# EAGLE design DarkPill_V1.1_eagle_V7.6 (EAGLE 7.7.0)

## Sheet 1 of 3
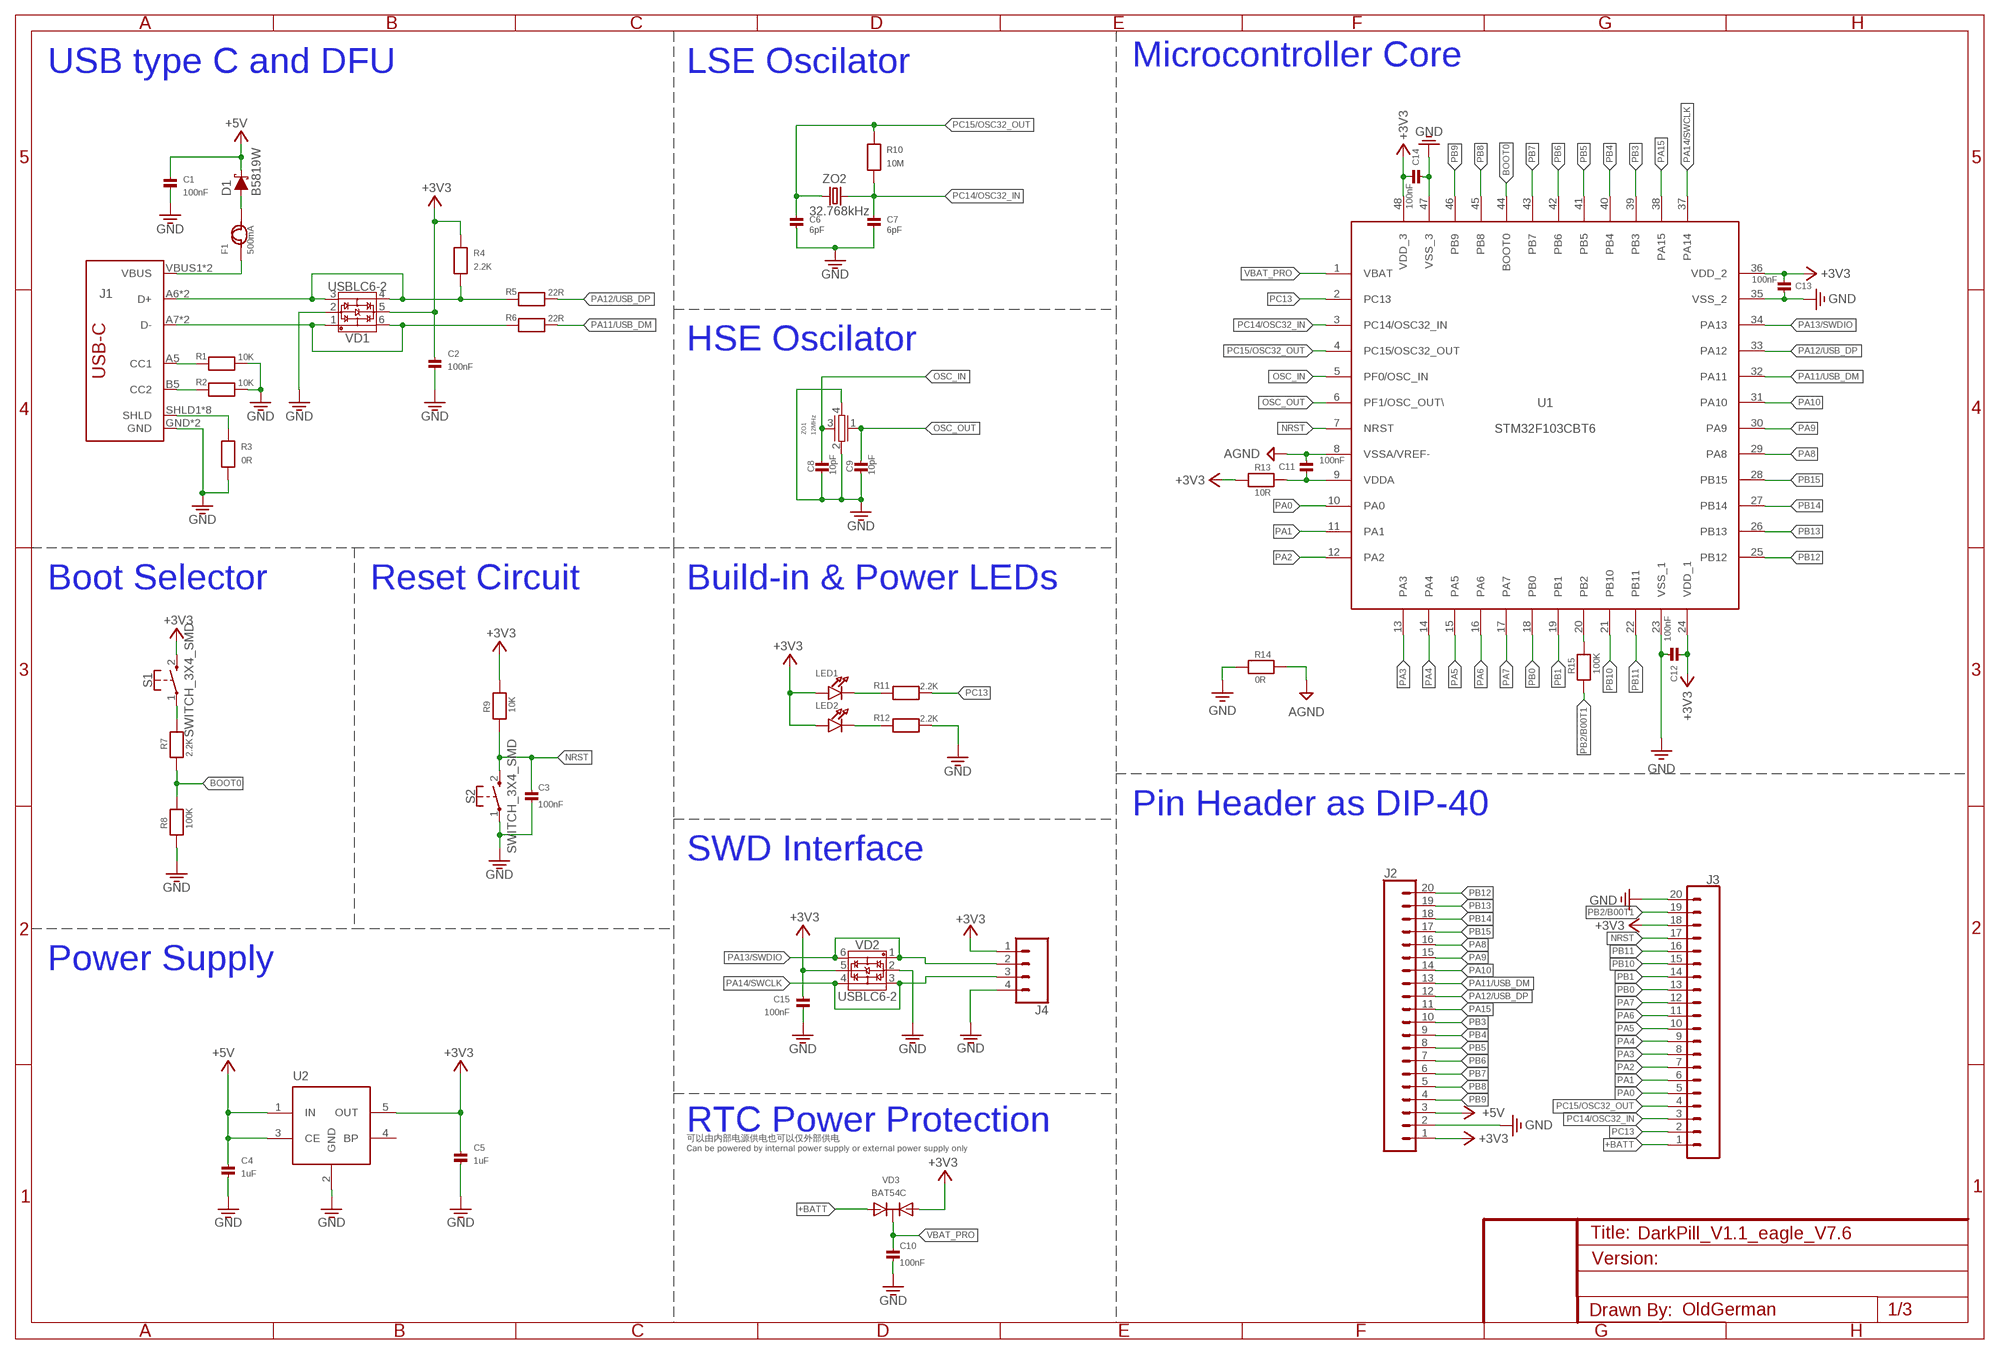
[diagram p0: schematic, sheet 1]

### Parts
C1  100nF  CAP_CERAMIC0603  [0603]
C2  100nF  CAP_CERAMIC0603  [0603]
C3  100nF  CAP_CERAMIC0603  [0603]
C4  1uF  CAP_CERAMIC0603  [0603]
C5  1uF  CAP_CERAMIC0603  [0603]
C6  6pF  CAP_CERAMIC0603  [0603]
C7  6pF  CAP_CERAMIC0603  [0603]
C8  10pF  CAP_CERAMIC0603  [0603]
C9  10pF  CAP_CERAMIC0603  [0603]
C10  100nF  CAP_CERAMIC0603  [0603]
C11  100nF  CAP_CERAMIC0603  [0603]
C12  100nF  CAP_CERAMIC0603  [0603]
C13  100nF  CAP_CERAMIC0603  [0603]
C14  100nF  CAP_CERAMIC0603  [0603]
C15  100nF  CAP_CERAMIC0603  [0603]
D1  B5819W  B5819W-SOD323  [SOD-323]
F1  500mA  FUSE  [0603]
J1  USB_C2-LAYER  [USB-C-16P]
J2  CONN_20  [1X20]
J3  CONN_20  [1X20]
J4  CONN_04PTH  [1X04]
LED1  LED_0603_MICRO  [0603_LED]
LED2  LED_0603_MICRO  [0603_LED]
R1  10K  RESISTOR0603  [0603]
R2  10K  RESISTOR0603  [0603]
R3  0R  RESISTOR0603  [0603]
R4  2.2K  RESISTOR0603  [0603]
R5  22R  RESISTOR0603  [0603]
R6  22R  RESISTOR0603  [0603]
R7  2.2K  RESISTOR0603  [0603]
R8  100K  RESISTOR0603  [0603]
R9  10K  RESISTOR0603  [0603]
R10  10M  RESISTOR0603  [0603]
R11  2.2K  RESISTOR0603  [0603]
R12  2.2K  RESISTOR0603  [0603]
R13  10R  RESISTOR0603  [0603]
R14  0R  RESISTOR0603  [0603]
R15  100K  RESISTOR0603  [0603]
S1  SWITCH_3X4_SMD  [SWITCH_3X4_SMD]
S2  SWITCH_3X4_SMD  [SWITCH_3X4_SMD]
U1  STM32F103CBT6  STM32F303CBT6  [TQFP48]
U2  ME6211C33M5G-N  [SOT23-5]
VD1  USBLC6-2  USBLC6-2SOT23-6  [SOT23-6]
VD2  USBLC6-2  USBLC6-2SOT23-6  [SOT23-6]
VD3  BAT54C  [SOT23-R]
ZO1  12MHz  3225_CRYSTALL  [3.2X2.5_KX-7]
ZO2  32.768kHz  KX-327-NHF  [3.2X1.5]

### Nets
+3V3: C2.1 C5.1 C12.2 C13.2 C14.2 C15.1 J2.1 J3.18 J4.1 LED1.1(A) LED2.1(A) R4.2 R9.1 R13.2 S1.2 U1.24(VDD_1) U1.36(VDD_2) U1.48(VDD_3) U2.5(OUT) VD1.5 VD2.5 VD3.1(A1)
+5V: C1.1 C4.1 D1.C J2.3 U2.1(IN) U2.3(CE)
+BATT: J3.1 VD3.2(A2)
AGND: C11.1 R14.1 U1.8(VSSA/VREF-)
BOOT0: R7.1 R8.1 U1.44(BOOT0)
CC1: J1.A5(CC1) R1.1
CC2: J1.B5(CC2) R2.1
D+: J1.A6(D+) J1.B6(D+) R4.1 R5.1 VD1.3 VD1.4
D-: J1.A7(D-) J1.B7(D-) R6.1 VD1.1 VD1.6
GND: C1.2 C2.2 C3.2 C4.2 C5.2 C6.1 C7.1 C8.1 C9.1 C10.2 C12.1 C13.1 C14.1 C15.2 J1.GND J1.GND2(GND) J2.2 J3.20 J4.4 R1.2 R2.2 R3.1 R8.2 R12.2 R14.2 S2.1 U1.23(VSS_1) U1.35(VSS_2) U1.47(VSS_3) U2.2(GND) VD1.2 VD2.2 ZO1.2 ZO1.4
N$1: LED1.2(C) R11.1
N$2: R7.2 S1.1
N$3: LED2.2(C) R12.1
N$5: R15.1 U1.20(PB2)
N$6: D1.A F1.2
N$7: C11.2 R13.1 U1.9(VDDA)
NRST: C3.1 J3.17 R9.2 S2.2 U1.7(NRST)
OSC_IN: C8.2 U1.5(PF0/OSC_IN) ZO1.3
OSC_OUT: C9.2 U1.6(PF1/OSC_OUT\) ZO1.1
PA0: J3.5 U1.10(PA0)
PA1: J3.6 U1.11(PA1)
PA2: J3.7 U1.12(PA2)
PA3: J3.8 U1.13(PA3)
PA4: J3.9 U1.14(PA4)
PA5: J3.10 U1.15(PA5)
PA6: J3.11 U1.16(PA6)
PA7: J3.12 U1.17(PA7)
PA8: J2.16 U1.29(PA8)
PA9: J2.15 U1.30(PA9)
PA10: J2.14 U1.31(PA10)
PA11/USB_DM: J2.13 R6.2 U1.32(PA11)
PA12/USB_DP: J2.12 R5.2 U1.33(PA12)
PA13/SWDIO: J4.2 U1.34(PA13) VD2.1 VD2.6
PA14/SWCLK: J4.3 U1.37(PA14) VD2.3 VD2.4
PA15: J2.11 U1.38(PA15)
PB0: J3.13 U1.18(PB0)
PB1: J3.14 U1.19(PB1)
PB2/B00T1: J3.19 R15.2
PB3: J2.10 U1.39(PB3)
PB4: J2.9 U1.40(PB4)
PB5: J2.8 U1.41(PB5)
PB6: J2.7 U1.42(PB6)
PB7: J2.6 U1.43(PB7)
PB8: J2.5 U1.45(PB8)
PB9: J2.4 U1.46(PB9)
PB10: J3.15 U1.21(PB10)
PB11: J3.16 U1.22(PB11)
PB12: J2.20 U1.25(PB12)
PB13: J2.19 U1.26(PB13)
PB14: J2.18 U1.27(PB14)
PB15: J2.17 U1.28(PB15)
PC13: J3.2 R11.2 U1.2(PC13)
PC14/OSC32_IN: C7.2 J3.3 R10.2 U1.3(PC14/OSC32_IN) ZO2.2
PC15/OSC32_OUT: C6.2 J3.4 R10.1 U1.4(PC15/OSC32_OUT) ZO2.1
SHLD: J1.SHLD1(SHLD) J1.SHLD2(SHLD) J1.SHLD3(SHLD) J1.SHLD4(SHLD) J1.SHLD5(SHLD) J1.SHLD6(SHLD) J1.SHLD7(SHLD) J1.SHLD8(SHLD) R3.2
VBAT_PRO: C10.1 U1.1(VBAT) VD3.3(C)
VBUS: F1.1 J1.VBUS1(VBUS) J1.VBUS2(VBUS)
Unconnected: U2.4(BP)

### Notes on the sheet
- USB type C and DFU | LSE Oscilator | Microcontroller Core
- HSE Oscilator
- Boot Selector | Reset Circuit | Build-in & Power LEDs
- Pin Header as DIP-40
- SWD Interface
- Power Supply
- RTC Power Protection
- 可以由内部电源供电也可以仅外部供电
  Can be powered by internal power supply or external power supply only
- OldGerman

## Sheet 2 of 3

## Sheet 3 of 3

## Library data of the parts
C1-C15 = microbuilder:CAP_CERAMIC: Ceramic Capacitors 0402 - 0402 Surface Mount Capacitors 16pF 50V 5% [Digikey: 445-4899-2-ND] 18pF 50V 5% [Digikey: 490-1281-2-ND] 22pF 50V 5% [Digikey: 490-1283-2-ND] 68pF 50V 5% [Digikey: 490-1289-2-ND] 0.1uF 10V 10% [Digikey: 490-1318-2-ND] 1.0uF 6.3V 10% [Digikey: 490-1320-2-ND] 0603 - 0603 Surface Mount Capacitors 16 pF 50V 5% [Digikey: 445-5051-2-ND] 22 pF 50V [Digikey: PCC220ACVTR-ND] 33 pF 50V 5% [Digikey: 490-1415-1-ND] 56pF 50V 5% [Digikey: 490-1421-1-ND] 220pF 50V 5% [Digikey: 445-1285-1-ND] 680 pF 50V 2200 pF 50V 5% C0G [Digikey: 445-1297-1-ND] 5600 pF 100V 5% X7R [Digikey: 478-3711-1-ND] 0.1 µF 25V 10% [Digikey: PCC2277TR-ND] 0.22 µF 16V 10% X7R [Digikey: 445-1318-1-ND] 1.0 µF 25V 10% [Digikey: 445-5146-2-ND] 0603 - RF Specific 3pF 250V +/-0.1pF RF [Digikey: 712-1347-1-ND] 18 pF 250V 5% [Digikey: 478-3505-1-ND or 712-1322-1-ND] 56 pF 250V 5% C0G RF [Digikey: 490-4867-1-ND] 68 pF 250V RF [Digikey: 490-4868-1-ND] 0805 - 0805 Surface Mount Capacitors 220 pF 250V 2% RF Ceramic Capacitor [Digikey: 712-1398-1-ND] 1000 pF 50V 2% NP0 Ceramic Capacitor [Digikey: 478-3760-1-ND] 0.1 µF 25V 10% Ceramic Capacitor [Digikey: PCC1828TR-ND] 1.0 µF 16V 10% Ceramic Capacitor[Digikey: 490-1691-2-ND] 10.0 µF 10V 10% Ceramic Capacitor[Digikey: 709-1228-1-ND] 10.0 uF 16V 10% Ceramic Capacitor [Digikey: 478-5165-2-ND] 47 uF 6.3V 20% Ceramic Capacitor [Digikey: 587-1779-1-ND or 399-5506-1-ND] 1206 - 1206 Surface Mount Capacitors 47uF 10V 20% Ceramic Capacitor [Digikey: 490-5528-1-ND or 399-5508-1-ND or 445-6010-1-ND] 100uF 6.3V -20%, +80% Y5V Ceramic Capacitor (Digikey: 490-4512-1-ND, Mouser: 81-GRM31CF50J107ZE1L)
D1 = DIP:B5819W-SOD323
F1 = DIP:FUSE
J1 = SparkFun-Connectors:USB_C: USB Type C 16Pin Connector Super Speed pins not available on the 16-pin purely SMD connector so this part is best for USB 2.0 implementations. D1 and D2 are tied together enabling D+/- no matter which way the cable is plugged into the connector. The two channel configuration pins (CC1/2) are exposed. These are normally connected to ground via 5.1k resistors but can be reconfigured for high current/high power applications.; PROD_ID: CONN-14122
J2 J3 = SparkFun-Connectors:CONN_20: Multi connection point. Often used as Generic Header-pin footprint for 0.1 inch spaced/style header connections On any of the 0.1 inch spaced packages, you can populate with these: Break Away Headers - Straight <https://www.sparkfun.com/products/116> (PRT-00116) Break Away Male Headers - Right Angle <https://www.sparkfun.com/products/553> (PRT-00553) Female Headers <https://www.sparkfun.com/products/115> (PRT-00115) Break Away Headers - Machine Pin <https://www.sparkfun.com/products/117> (PRT-00117) Break Away Female Headers - Swiss Machine Pin <https://www.sparkfun.com/products/743> (PRT-00743) For SCREWTERMINALS and SPRING TERMINALS visit here: Screw Terimnals on SparkFun.com <https://www.sparkfun.com/search/results?term=Screw+Terminals> (5mm/3.5mm/2.54mm spacing) This device is also useful as a general connection point to wire up your design to another part of your project. Our various solder wires solder well into these plated through hole pads. Hook-Up Wire - Assortment (Stranded, 22 AWG) <https://www.sparkfun.com/products/11375> (PRT-11375) Hook-Up Wire - Assortment (Solid Core, 22 AWG) <https://www.sparkfun.com/products/11367> (PRT-11367) View the entire wire category on our website here <https://www.sparkfun.com/categories/141> Special notes: Molex polarized connector foot print use with SKU : PRT-08231 with associated crimp pins and housings. 1MM SMD Version SKU: PRT-10208 NOTES ON THE VARIANTS LOCK and LOCK_LONGPADS... This footprint was designed to help hold the alignment of a through-hole component (i.e. 6-pin header) while soldering it into place. You may notice that each hole has been shifted either up or down by 0.005 of an inch from it's more standard position (which is a perfectly straight line). This slight alteration caused the pins (the squares in the middle) to touch the edges of the holes. Because they are alternating, it causes a "brace" to hold the component in place. 0.005 has proven to be the perfect amount of "off-center" position when using our standard breakaway headers. Although looks a little odd when you look at the bare footprint, once you have a header in there, the alteration is very hard to notice. Also,if you push a header all the way into place, it is covered up entirely on the bottom side. Note about LOCK SPECIAL package: This is just like the LOCK variant in that the holes are staggared by 5 mil, but except for the last two holes. They are not altered from the "standard" footprint layout. This is used for a special purpose on the layout of our Graphic LCD Backpack. Make sure you want to use this device before selecting it for you project!
J4 = SparkFun-Connectors:CONN_04: Multi connection point. Often used as Generic Header-pin footprint for 0.1 inch spaced/style header connections On any of the 0.1 inch spaced packages, you can populate with these: Break Away Headers - Straight <https://www.sparkfun.com/products/116> (PRT-00116) Break Away Male Headers - Right Angle <https://www.sparkfun.com/products/553> (PRT-00553) Female Headers <https://www.sparkfun.com/products/115> (PRT-00115) Break Away Headers - Machine Pin <https://www.sparkfun.com/products/117> (PRT-00117) Break Away Female Headers - Swiss Machine Pin <https://www.sparkfun.com/products/743> (PRT-00743) For SCREWTERMINALS and SPRING TERMINALS visit here: Screw Terimnals on SparkFun.com <https://www.sparkfun.com/search/results?term=Screw+Terminals> (5mm/3.5mm/2.54mm spacing) This device is also useful as a general connection point to wire up your design to another part of your project. Our various solder wires solder well into these plated through hole pads. Hook-Up Wire - Assortment (Stranded, 22 AWG) <https://www.sparkfun.com/products/11375> (PRT-11375) Hook-Up Wire - Assortment (Solid Core, 22 AWG) <https://www.sparkfun.com/products/11367> (PRT-11367) View the entire wire category on our website here <https://www.sparkfun.com/categories/141> Special notes: Molex polarized connector foot print use with SKU : PRT-08231 with associated crimp pins and housings. 1MM SMD Version SKU: PRT-10208; PROD_ID: CONN-09696
LED1 LED2 = DIP:LED_0603_MICRO: LED 0603 - 0603 Surface Mount Package 2mA: Green LED - Low Power (3.9mcd, 2ma, 1.7Vf) - Digikey: 475-2709-2-ND Orange LED - Low Power (9.8mcd, 2ma, 1.8Vf) - Digikey: 475-1194-2-ND Red LED - Low Power (5mcd, 2ma, 1.8Vf) - Digikey: 475-1195-2-ND Yellow LED - Low Power (7mcd, 2ma, 1.8Vf) - Digikey: 475-1196-2-ND 5mA: Blue LED - Low Power (17mcd, 5ma, 2.9Vf) - Digikey: LNJ937W8CRACT-ND 0805 - 0805 Surface Mount Package 2mA: Red LED (8.8mcd, 2mA, 1.8Vf, Clear) - Low Power [Digikey: 475-2510-1-ND] Green LED (5mcd, 2mA, 1.8Vf, Clear) - Low Power [Digikey: 475-2730-1-ND] Yellow LED (11.3mcd, 2mA, 1.8Vf, Clear) - Low Power [Digikey: 475-2555-1-ND] 20mA: Red LED (104mcd, 20mA, Diffused) - LS R976 [Digikey: 475-1278-6-ND] Red LED (12mcd, 20mA, 2.0Vf, Clear) - APT2012EC [Digikey: 754-1128-1-ND] Green LED (15mcd, 20mA, 2.2Vf, Clear) - APT2012GC [Digikey: 754-1131-1-ND] Orange LED (160mcd, 20mA, 2.1Vf, Clear) - APT2012SECK [Digikey: 754-1130-1-ND] 1206 - 1206 Surface Mount Package Green LED (26mcd, 20mA, Diffused) - LG N971 [Digikey: 475-1407-6-ND] Red LED (15mcd, 20mA, Diffused) - LH N974 [Digikey: 475-1416-6-ND]
R1-R15 = microbuilder:RESISTOR: Resistors 0402 - 0402 Surface Mount Package 22 Ohm 1% 1/16W [Digikey: 311-22.0LRTR-ND] 33 Ohm 5% 1/16W 1.0K 5% 1/16W 1.5K 5% 1/16W 2.0K 1% 1/16W 10.0K 1% 1/16W [Digikey: 311-10.0KLRTR-ND] 10.0K 5% 1/16W [Digikey: RMCF0402JT10K0TR-ND] 12.1K 1% 1/16W [Digikey: 311-22.0LRTR-ND] 100.0K 5% 1/16W 0603 - 0603 Surface Mount Package 0 Ohm 1/10 Watt 1% Resistor 15 Ohm 1/10 Watt 1% Resistor 33 Ohm 1/10 Watt 1% Resistor 49.9 Ohm 1/10 Watt 1% Resistor 100 Ohm 1/10 Watt 1% Resistor 150 Ohm 1/10 Watt 1% Resistor 240 Ohm 1/10 Watt 1% Resistor 390 Ohm 1/10 Watt 1% Resistor 560 Ohm 1/10 Watt 1% Resistor 680 Ohm 1/10 Watt 1% Resistor 750 Ohm 1/10 Watt 1% Resistor 1.0K Ohm 1/10 Watt 1% Resistor 1.5K Ohm 1/10 Watt 1% Resistor 2.0K Ohm 1/10 Watt 1% Resistor 2.2K Ohm 1/10 Watt 1% Resistor 3.3K Ohm 1/10 Watt 1% Resistor 4.7K Ohm 1/10 Watt 1% Resistor 10.0K Ohm 1/10 Watt 1% Resistor 12.0K Ohm 1/10 Watt 1% Resistor 12.1K Ohm 1/10 Watt 1% Resistor 20.0K Ohm 1/10 Watt 1% Resistor 33.0K Ohm 1/10 Watt 1% Resistor 100.0K Ohm 1/10 Watt 1% Resistor 0805 - 0805 Surface Mount Package 0 Ohm 1/8 Watt 1% Resistor 33 Ohm 1/8 Watt 1% Resistor 100 Ohm 1/8 Watt 1% Resistor 150 Ohm 1/8 Watt 1% Resistor 200 Ohm 1/8 Watt 1% Resistor 240 Ohm 1/8 Watt 1% Resistor 330 Ohm 1/8 Watt 1% Resistor 390 Ohm 1/8 Watt 1% Resistor 470 Ohm 1/8 Watt 1% Resistor 1.0K Ohm 1/8 Watt 1% Resistor 1.5K Ohm 1/8 Watt 1% Resistor 2.0K Ohm 1/8 Watt 1% Resistor 4.7K Ohm 1/8 Watt 1% Resistor 5.1K Ohm 1/8 Watt 1% Resistor 5.6K Ohm 1/8 Watt 1% Resistor 10.0K Ohm 1/8 Watt 1% Resistor 22.0K Ohm 1/8 Watt 1% Resistor 33.0K Ohm 1/8 Watt 1% Resistor 100K Ohm 1/8 Watt 1% Resistor 1206 - 1206 Surface Mount Package 2012 - 2010 Surface Mount Package 0.11 Ohm 1/2 Watt 1% Resistor - Digikey: RHM.11UCT-ND
S1 S2 = DIP:SWITCH_3X4_SMD
U1 = stm32f10X:STM32F303CBT6
U2 = SparkFun-IC-Power:ME6211C33M5G-N: ME621133M5G-N SOT23-5 3.3V 500mA 低差压线性稳压器
VD1 VD2 = ESD-protection:USBLC6-2
VD3 = microbuilder:BAT54C: BAT54C Schottky Diodes (Common Cathode) Vf: 800mV, 30V 200mA Digikey: BAT54CFSCT-ND For 300mA see BAT54CFILM: Vf: 900mV, 40V 300mA Digkey: 497-3786-2-ND
ZO1 = DIP:3225_CRYSTALL
ZO2 = crystal-geyer_V1_0:KX-327: Tuning Fork Crystals (kHz) SMD: KX327 - Serie Model Size l/w/h [mm] Frequency Range Frequency Stability Temp. Range [°C] Load Capacitance AECQ 200 availabel Datasheet KX-327VT KX-327FT KX-327RT KX-327NHT KX-327NHF KX-327L KX-327S 1.25/1.05/0.5 1.6/1.0/0.5 2.0/1.2/0.6 3.2/1.5/0.8 3.2/1.5/0.8 7.0/1.5/1.4 8.2/3.8/2.5 32,768 kHz 32,768 kHz 32,768 kHz 32,768 kHz 32,768 kHz 32,768 kHz 32,768 kHz ±10 … ±20ppm ±10 … ±20ppm ±10 … ±20ppm ±10 … ±20ppm ±10 … ±20ppm ±10 … ±20ppm ±5 … ±20ppm (*) -40°C …+85°C (*) -40°C …+85°C (*) -40°C …+85°C (*) -40°C …+85°C (*) -40°C …+125°C (*) -40°C …+85°C (*) -40°C …+85°C 7/9/12,5 7/9/12,5 7/9/12,6 7/9/12,5 9/12,5 7/9/12,5 6/12,5 - - - - yes - - KX-327VT.pdf <http://www.geyer-electronic.de/uploads/tx_userartikelfrequenz/GEYER-KX-327VT.pdf> KX-327FT.pdf <http://www.geyer-electronic.de/uploads/tx_userartikelfrequenz/GEYER-KX-327FT.pdf> KX-327RT.pdf <http://www.geyer-electronic.de/uploads/tx_userartikelfrequenz/GEYER-KX-327RT.pdf> KX-327NHT.pdf <http://www.geyer-electronic.de/uploads/tx_userartikelfrequenz/GEYER-KX-327NHT.pdf> KX-327NHF.pdf <http://www.geyer-electronic.de/uploads/tx_userartikelfrequenz/GEYER-KX-327NHF.pdf> KX-327L.pdf <http://www.geyer-electronic.de/uploads/tx_userartikelfrequenz/GEYER-KX-327L.pdf> KX-327S.pdf <http://www.geyer-electronic.de/uploads/tx_userartikelfrequenz/GEYER-KX-327S.pdf> <http://www.geyer-electronic.de/fileadmin/template/img/logo-geyer-electronic.png> Details see: http://www.geyer-electronic.de/Frequenz-Produkte.9.0.html Created 2016-06-07, Hans Locher 2016 (C) Geyer Quartz Technology KX327VT,KX327FT,KX327RT,KX327NHT,KX327NHF,KX327S,KX327L;125105;1610;2012;3215;7015;8238;1,25x1,05,1.25x1.05;1,6x1,0,1.6x1.0;2,0x1,2,2.0x1.2;3,2x1,5,3.2x1.5;8,2x3,8,8.2x3.8,7.0x1.5,7,0x1,532.768kHz

## Board
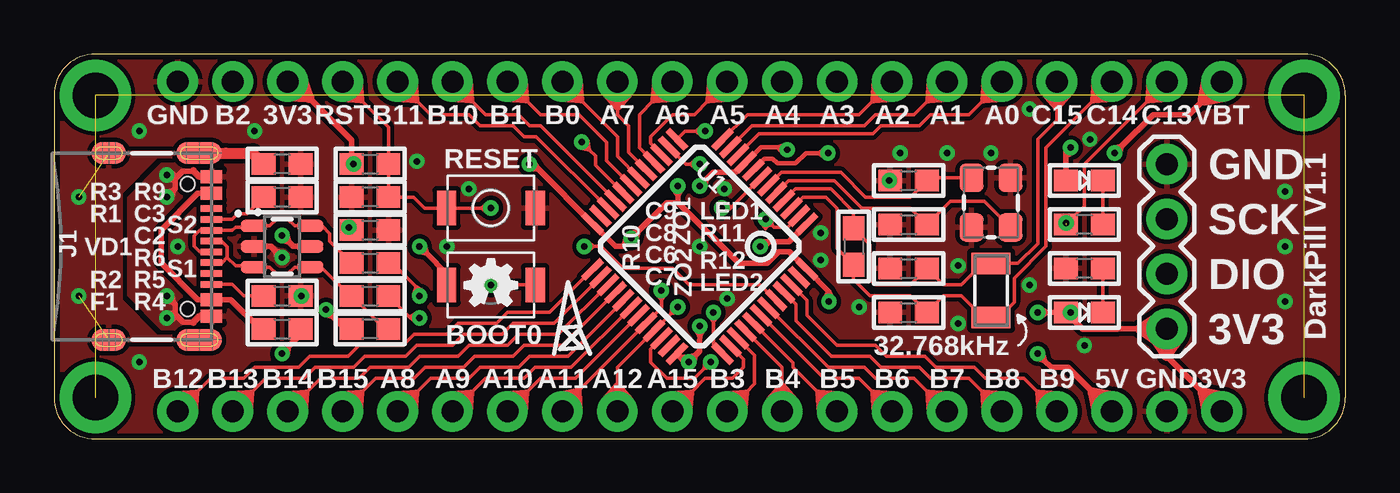
[diagram p1: board, top side]
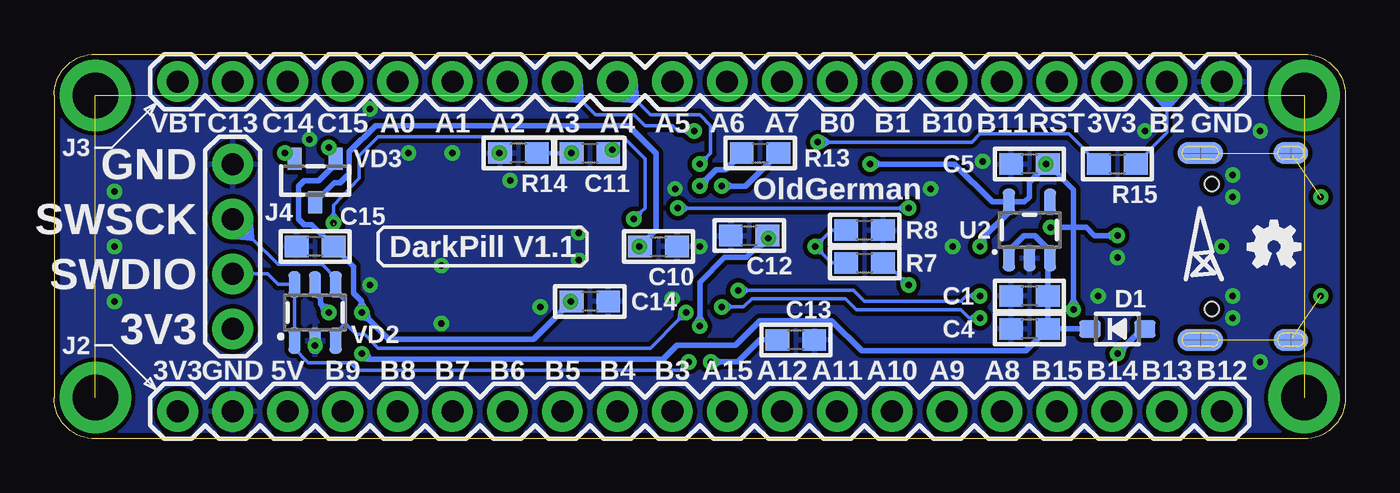
[diagram p2: board, bottom side, seen from below]

Size 59.69 x 17.78 mm. Coordinates in mm from the lower left corner, seen from the top.
Outline: 1.9,17.78 arc90 0,15.88 0,1.91 arc90 1.9,0 57.78,0 arc90 59.69,1.91 59.69,15.88 arc90 57.78,17.78 1.9,17.78
Copper layers (1*16): Top 0.035mm / dielectric 1.5mm / Bottom 0.035mm
Design rules "default *": minimum track width 6mil, minimum drill 0.3mm, track to track 8mil, track to pad 6mil, pad to pad 6mil, via to via 6mil, smd to smd 6mil, copper to edge 10mil, drill to drill 6mil, minimum pad ring 10mil, minimum via ring 8mil, stop-mask expansion 1mil, vias tented up to drill 20mil, thermal gap 8mil

### Footprints (pad centres in the part's own frame; a part is rotated, then mirrored left to right if it is on the bottom)
0603 = smd 1.1 x 1: 1 -0.85,0; 2 0.85,0
SOD-323 = smd 1 x 0.8: A 1.27,0; C -1.27,0
USB-C-16P = smd 0.3 x 1: A5 -1.25,-0.34; A6 -0.25,-0.34; A7 0.25,-0.34; A8 1.25,-0.34; B5 1.75,-0.34; B6 0.75,-0.34; B7 -0.75,-0.34; B8 -1.75,-0.34 | smd 0.6 x 1: GND -3.225,-0.34; GND2 3.225,-0.34; VBUS1 -2.45,-0.34; VBUS2 2.45,-0.34 | smd 1 x 2.1: SHLD1 -4.32,-0.915; SHLD2 4.32,-0.915 | smd 1 x 2.1 bottom: SHLD3 -4.32,-0.915; SHLD4 4.32,-0.915 | smd 1 x 1.6: SHLD5 -4.32,-5.095; SHLD8 4.32,-5.095 | smd 1 x 1.6 bottom: SHLD6 -4.32,-5.095; SHLD7 4.32,-5.095 | hole 0.65: -2.89,-1.445; 2.89,-1.445
1X20 = drill 1.016 pad 1.88: 1 0,0; 2 2.54,0; 3 5.08,0; 4 7.62,0; 5 10.16,0; 6 12.7,0; 7 15.24,0; 8 17.78,0; 9 20.32,0; 10 22.86,0; 11 25.4,0; 12 27.94,0; 13 30.48,0; 14 33.02,0; 15 35.56,0; 16 38.1,0; 17 40.64,0; 18 43.18,0; 19 45.72,0; 20 48.26,0
1X04 = drill 1.016 pad 1.88: 1 0,0; 2 2.54,0; 3 5.08,0; 4 7.62,0
0603_LED = smd 1.1 x 1: 1 -0.85,0; 2 0.85,0
SWITCH_3X4_SMD = smd 0.9 x 1.6: 1 -2.05,0; 2 2.05,0
TQFP48 = smd 0.3 x 1.2: 1 -2.75,-4.25; 2 -2.25,-4.25; 3 -1.75,-4.25; 4 -1.25,-4.25; 5 -0.75,-4.25; 6 -0.25,-4.25; 7 0.25,-4.25; 8 0.75,-4.25; 9 1.25,-4.25; 10 1.75,-4.25; 11 2.25,-4.25; 12 2.75,-4.25; 25 2.75,4.25; 26 2.25,4.25; 27 1.75,4.25; 28 1.25,4.25; 29 0.75,4.25; 30 0.25,4.25; 31 -0.25,4.25; 32 -0.75,4.25; 33 -1.25,4.25; 34 -1.75,4.25; 35 -2.25,4.25; 36 -2.75,4.25 | smd 1.2 x 0.3: 13 4.25,-2.75; 14 4.25,-2.25; 15 4.25,-1.75; 16 4.25,-1.25; 17 4.25,-0.75; 18 4.25,-0.25; 19 4.25,0.25; 20 4.25,0.75; 21 4.25,1.25; 22 4.25,1.75; 23 4.25,2.25; 24 4.25,2.75; 37 -4.25,2.75; 38 -4.25,2.25; 39 -4.25,1.75; 40 -4.25,1.25; 41 -4.25,0.75; 42 -4.25,0.25; 43 -4.25,-0.25; 44 -4.25,-0.75; 45 -4.25,-1.25; 46 -4.25,-1.75; 47 -4.25,-2.25; 48 -4.25,-2.75
SOT23-5 = smd 0.55 x 1.2: 1 -0.95,-1.3; 2 0,-1.3; 3 0.95,-1.3; 4 0.95,1.3; 5 -0.95,1.3
SOT23-6 = smd 0.55 x 1.2: 1 0.95,1.3; 2 0,1.3; 3 -0.95,1.3; 4 -0.95,-1.3; 5 0,-1.3; 6 0.95,-1.3
SOT23-R = smd 0.635 x 1.016: 1 -0.95,-1; 2 0.95,-1; 3 0,1
3.2X2.5_KX-7 = smd 1.3 x 1.1: 1 -1.15,-0.9; 2 1.15,-0.9; 3 1.15,0.9; 4 -1.15,0.9
3.2X1.5 = smd 1 x 1.8: 1 -1.25,0; 2 1.25,0

### Placement (x,y rotation side)
C1  14.6,6.6 180 bottom
C2  14.6,9.65 0 top
C3  14.6,11.18 180 top
C4  14.6,5.08 180 bottom
C5  14.6,12.7 180 bottom
C6  39.5,7.87 0 top
C7  39.5,5.84 0 top
C8  39.5,9.91 0 top
C9  39.5,11.94 0 top
C10  31.75,8.89 0 bottom
C11  34.92,13.21 0 bottom
C12  27.56,9.4 0 bottom
C13  25.4,4.57 180 bottom
C14  34.92,6.35 180 bottom
C15  47.62,8.89 180 bottom
D1  10.54,5.08 0 bottom
F1  10.54,5.08 0 top
J1  7.62,8.89 270 top
J2  53.97,1.27 0 bottom
J3  53.97,16.51 0 bottom
J4  51.44,5.08 90 top
LED1  47.62,11.94 0 top
LED2  47.62,5.84 0 top
R1  10.54,11.18 0 top
R2  10.54,6.6 0 top
R3  10.54,12.7 180 top
R4  14.6,5.08 180 top
R5  14.6,6.6 0 top
R6  14.6,8.13 0 top
R7  22.22,8.13 0 bottom
R8  22.22,9.65 0 bottom
R9  14.6,12.7 0 top
R10  36.96,8.89 270 top
R11  47.62,9.91 180 top
R12  47.62,7.87 180 top
R13  27.05,13.21 0 bottom
R14  38.23,13.21 180 bottom
R15  10.54,12.7 0 bottom
S1  20.19,7.11 180 top
S2  20.19,10.67 180 top
U1  29.84,8.89 135 top
U2  14.6,9.65 0 bottom
U$1  [OSHW-LOGO-MINI]  20.19,7.11 0 top
U$2  [OSHW-LOGO-MINI]  3.3,8.89 0 bottom
U$3  [CREATIVE_COMMONS]  6.73,-10.92 0 top  (outside the outline)
VD1  10.54,8.89 90 top
VD2  47.62,5.84 180 bottom
VD3  47.62,11.94 180 bottom
ZO1  43.31,10.92 270 top
ZO2  43.31,6.86 270 top

### Tracks (layer width: path | path; a pad name or v marks a point on that pad's centre or on a via)
+3V3  (via drill 0.3)
  Top 0.254: v29.34,3.56 29.17,3.56 28.95,3.78 | U1.36 28.95,3.78 | 26.35,8.95 26.29,8.89 25.96,8.89 U1.24 22.36,12.48 | 26.35,8.95 v26.67,9.27 | VD1.5 11.05,8.89 10.86,9.08 | 10.86,9.08 v10.54,9.4 | v13.84,12.7 R9.1 13.75,13.14 | J2.1 53.11,2.13 51.44,3.81 51.44,3.86 J4.1 50.22,5.08 49.16,5.08 49.14,5.06 47.55,5.06 47.18,5.44 | 13.75,13.14 13.75,13.8 11.77,15.78 11.05,16.51 J3.18 | 35.81,6.8 | 35.81,6.8 v35.81,6.35 | 47.18,5.44 LED2.1 | 28.83,10.92 31.65,8.11 32.96,8.11 33.49,8.64 33.99,8.64 U1.48 35.82,6.81 35.81,6.8 | 28.83,10.92 28.32,10.92 26.99,9.59 | 26.99,9.59 v26.67,9.27 | 22.36,12.48 22.15,12.7 v21.97,12.7 | LED1.1 46.77,13.07 | 46.77,13.07 46.77,13.25 v46.99,13.46 | v12.57,5.97 12.89,5.65 | 12.89,5.65 13.46,5.08 R4.2 | 46.46,5.53 46.58,5.65 | 46.58,5.65 LED2.1 | S1.2 18.14,7.64 17.21,8.57 | 17.21,8.57 v16.89,8.89 | v29.34,3.56 29.65,3.87 | 29.65,3.87 29.84,4.06 v29.84,5.21 | C2.1 v13.63,9.78 | v28.83,11.68 28.83,11.23 | 28.83,11.23 | 28.83,11.23 28.83,10.92 | v46.99,5.84 LED2.1 | v45.47,5.84 45.92,5.84 | 45.92,5.84 46.54,5.84 | 46.54,5.84 LED2.1 | 28.95,3.78 29.14,3.44 v29.34,3.56 | 28.95,3.78 29.33,3.78 v29.34,3.56 | 29.65,3.87 29.28,3.78 v29.34,3.56 | 29.65,3.87 29.56,3.5 v29.34,3.56 | 26.35,8.95 26.73,9.05 v26.67,9.27 | 26.35,8.95 26.45,9.33 v26.67,9.27 | 26.99,9.59 26.61,9.49 v26.67,9.27 | 26.99,9.59 26.89,9.21 v26.67,9.27 | 10.86,9.08 10.76,9.46 v10.54,9.4 | 10.86,9.08 10.48,9.18 v10.54,9.4 | 13.75,13.14 13.63,12.77 v13.84,12.7 | 13.75,13.14 14.01,12.85 v13.84,12.7 | 35.81,6.8 | 35.81,6.8 35.62,6.46 | 35.81,6.8 36.01,6.46 | 35.81,6.8 35.62,6.46 | 35.81,6.8 36.01,6.46 | v35.81,6.35 36.01,6.46 | 35.81,6.8 35.62,6.46 | v35.81,6.35 35.62,6.46
  Top 0.254: 35.81,6.8 36.01,6.46 | 35.81,6.8 35.62,6.46 | v35.81,6.35 35.62,6.46 | 35.81,6.8 36.01,6.46 | v35.81,6.35 36.01,6.46 | 35.81,6.8 35.62,6.46 | v35.81,6.35 35.62,6.46 | 35.81,6.8 36.01,6.46 | v35.81,6.35 36.01,6.46 | 22.36,12.48 22.16,12.82 v21.97,12.7 | 22.36,12.48 21.97,12.47 v21.97,12.7 | 46.77,13.07 47.11,13.27 v46.99,13.46 | 46.77,13.07 46.76,13.46 v46.99,13.46 | 12.89,5.65 12.79,6.03 v12.57,5.97 | 12.89,5.65 12.52,5.75 v12.57,5.97 | 47.18,5.44 47.22,5.82 v46.99,5.84 | 47.18,5.44 46.86,5.66 v46.99,5.84 | 46.58,5.65 46.97,5.62 v46.99,5.84 | 46.58,5.65 46.8,5.97 v46.99,5.84 | 46.54,5.84 46.88,5.65 v46.99,5.84 | 46.54,5.84 46.88,6.04 v46.99,5.84 | 17.21,8.57 17.11,8.95 v16.89,8.89 | 17.21,8.57 16.83,8.67 v16.89,8.89 | 29.84,4.76 30.04,5.09 | v29.84,5.21 30.04,5.09 | 29.84,4.76 30.04,5.09 | v29.84,5.21 30.04,5.09 | 29.84,4.76 29.65,5.09 v29.84,5.21 | 28.83,11.23 | 28.83,11.23 29.02,11.57 | v28.83,11.68 29.02,11.57 | 28.83,11.23 28.63,11.57 | v28.83,11.68 28.63,11.57 | 28.83,11.23 29.02,11.57 | v28.83,11.68 29.02,11.57 | 28.83,11.23 28.63,11.57 | v28.83,11.68 28.63,11.57 | 28.83,11.23 29.02,11.57 | v28.83,11.68 29.02,11.57 | 28.83,11.23 28.63,11.57 | v28.83,11.68 28.63,11.57 | 45.92,5.84 45.58,6.04 v45.47,5.84 | 45.92,5.84 45.58,5.65 v45.47,5.84
  Top 0.508: J4.1 52,4.69 51.44,3.86 50.87,4.69 J4.1 | J4.1 51.05,4.51 50.22,5.08 51.05,5.65 J4.1 | 53.11,2.13 53.3,1.14 J2.1 54.1,1.94 53.11,2.13 | 11.77,15.78 11.44,16.74 J3.18 10.77,15.82 11.77,15.78
  Bottom 0.254: v29.34,3.56 28.89,3.56 | 28.89,3.56 | 28.89,3.56 28.07,3.56 27.05,4.57 C13.2 | v10.54,9.4 10.99,9.4 | 10.99,9.4 | 10.99,9.4 11.6,9.4 11.98,9.78 12.57,9.78 | v13.63,9.78 13.18,9.78 | 13.18,9.78 | 13.18,9.78 12.57,9.78 | 14.11,12.34 14.6,11.85 14.6,11.18 14.83,10.95 U2.5 | 14.11,12.34 R9.1 | R9.1 13.48,12.43 | 13.48,12.43 | 13.48,12.43 12.57,11.52 12.57,9.78 | R9.1 v13.84,12.7 | v46.99,13.46 46.67,13.15 46.67,13.14 | 46.67,13.14 VD3.1 46.72,12.94 46.59,12.81 47.47,11.94 48.13,11.94 48.39,11.68 48.39,10.16 48.13,9.91 47.79,9.91 C15.1 45.85,7.96 45.85,6.73 45.47,6.35 45.47,6.29 | 12.57,9.78 12.57,6.42 | 12.57,6.42 | 12.57,6.42 v12.57,5.97 | v21.97,12.7 21.52,12.7 | 21.52,12.7 | 21.52,12.7 18.06,12.7 16.32,10.95 U2.5 | 27.21,8.86 27.69,8.38 28.7,8.38 29.84,7.24 29.84,5.66 | 27.21,8.86 27.16,8.91 26.99,8.95 | 26.99,8.95 v26.67,9.27 | C12.2 26.67,9.36 v26.67,9.27 | 29.84,5.66 | 29.84,5.66 v29.84,5.21 | v16.89,8.89 16.89,9.14 16.73,9.31 | 16.73,9.31 15.55,10.48 U2.5 | 27.21,8.86 27.11,9.21 | 27.11,9.21 27.07,9.38 26.89,9.33 | 36.11,6.01 37.52,4.61 44.23,4.61 45.15,5.52 | 36.11,6.01 C14.2 v35.81,6.35 | R13.2 27.72,11.68 28.38,11.68 | 28.38,11.68 | 28.38,11.68 v28.83,11.68 | 13.48,12.43 | 13.48,12.43 13.87,12.48 | 13.87,12.48 | 13.48,12.43 13.63,12.79 | VD2.5 47.62,6.76 47.37,6.51 47.37,6.25 47.29,6.18 | 47.29,6.18 46.99,5.87 v46.99,5.84 | v45.47,5.84 45.15,5.52 | v45.47,5.84 45.47,6.29 | 45.47,6.29 | 28.89,3.56 29.22,3.36 | 28.89,3.56 | 28.89,3.56 29.22,3.36 | v29.34,3.56 29.22,3.36 | 28.89,3.56 | 28.89,3.56 29.22,3.75 | 28.89,3.56 29.22,3.36 | 28.89,3.56 | 28.89,3.56 29.22,3.75 | v29.34,3.56 29.22,3.75 | 28.89,3.56 29.22,3.36 | 28.89,3.56 29.22,3.75 | 28.89,3.56 29.22,3.36
  Bottom 0.254: v29.34,3.56 29.22,3.36 | 28.89,3.56 29.22,3.75 | v29.34,3.56 29.22,3.75 | 28.89,3.56 29.22,3.36 | v29.34,3.56 29.22,3.36 | 28.89,3.56 29.22,3.75 | v29.34,3.56 29.22,3.75 | 27.11,9.21 26.81,9.45 v26.67,9.27 | 27.11,9.21 26.75,9.06 v26.67,9.27 | 26.99,8.95 26.89,9.33 | v26.67,9.27 26.89,9.33 | 26.99,8.95 26.61,9.05 v26.67,9.27 | 10.99,9.4 10.65,9.59 | 10.99,9.4 | 10.99,9.4 10.65,9.59 | v10.54,9.4 10.65,9.59 | 10.99,9.4 | 10.99,9.4 10.65,9.2 | 10.99,9.4 10.65,9.59 | 10.99,9.4 | 10.99,9.4 10.65,9.2 | v10.54,9.4 10.65,9.2 | 10.99,9.4 10.65,9.59 | 10.99,9.4 10.65,9.2 | 10.99,9.4 10.65,9.59 | v10.54,9.4 10.65,9.59 | 10.99,9.4 10.65,9.2 | v10.54,9.4 10.65,9.2 | 10.99,9.4 10.65,9.59 | v10.54,9.4 10.65,9.59 | 10.99,9.4 10.65,9.2 | v10.54,9.4 10.65,9.2 | 13.18,9.78 13.51,9.98 | 13.18,9.78 | 13.18,9.78 13.51,9.58 | v13.63,9.78 13.51,9.58 | 13.18,9.78 13.51,9.98 | 13.18,9.78 | 13.18,9.78 13.51,9.58 | 13.18,9.78 | 13.18,9.78 13.51,9.98 | v13.63,9.78 13.51,9.98 | 13.18,9.78 13.51,9.58 | v13.63,9.78 13.51,9.58 | 13.18,9.78 13.51,9.98 | v13.63,9.78 13.51,9.98 | 13.18,9.78 13.51,9.58 | 13.18,9.78 13.51,9.98 | 13.18,9.78 13.51,9.58 | v13.63,9.78 13.51,9.58 | 13.18,9.78 13.51,9.98 | v13.63,9.78 13.51,9.98 | 14.11,12.34 | 14.11,12.34 14.07,12.73 | 14.07,12.73 | 14.11,12.34 | 13.48,12.43 | 13.48,12.43 13.87,12.48 | 13.48,12.43 13.63,12.79 | 14.11,12.34 14.07,12.73 | 14.11,12.34 13.75,12.49 | 14.11,12.34 14.07,12.73 | v13.84,12.7 14.07,12.73 | 14.11,12.34 13.75,12.49 | v13.84,12.7 13.75,12.49 | 13.48,12.43 13.87,12.48 | v13.84,12.7 13.87,12.48 | 13.48,12.43 13.63,12.79 | v13.84,12.7 13.63,12.79 | 36.11,6.01 36.04,6.39 v35.81,6.35 | 36.11,6.01 35.74,6.14 v35.81,6.35 | 21.52,12.7 21.86,12.9 | 21.52,12.7 | 21.52,12.7 21.86,12.5
  Bottom 0.254: v21.97,12.7 21.86,12.5 | 21.52,12.7 21.86,12.9 | 21.52,12.7 | 21.52,12.7 21.86,12.5 | 21.52,12.7 | 21.52,12.7 21.86,12.9 | v21.97,12.7 21.86,12.9 | 21.52,12.7 21.86,12.5 | v21.97,12.7 21.86,12.5 | 21.52,12.7 21.86,12.9 | v21.97,12.7 21.86,12.9 | 21.52,12.7 21.86,12.5 | 21.52,12.7 21.86,12.9 | 21.52,12.7 21.86,12.5 | v21.97,12.7 21.86,12.5 | 21.52,12.7 21.86,12.9 | v21.97,12.7 21.86,12.9 | 46.67,13.14 47.05,13.24 v46.99,13.46 | 46.67,13.14 46.77,13.52 v46.99,13.46 | 12.57,6.42 12.38,6.08 | 12.57,6.42 | 12.57,6.42 12.38,6.08 | v12.57,5.97 12.38,6.08 | 12.57,6.42 | 12.57,6.42 12.77,6.08 | 12.57,6.42 12.38,6.08 | 12.57,6.42 | 12.57,6.42 12.77,6.08 | v12.57,5.97 12.77,6.08 | 12.57,6.42 12.38,6.08 | 12.57,6.42 12.77,6.08 | 12.57,6.42 12.38,6.08 | v12.57,5.97 12.38,6.08 | 12.57,6.42 12.77,6.08 | v12.57,5.97 12.77,6.08 | 12.57,6.42 12.38,6.08 | v12.57,5.97 12.38,6.08 | 12.57,6.42 12.77,6.08 | v12.57,5.97 12.77,6.08 | 47.29,6.18 46.92,6.06 v46.99,5.84 | 47.29,6.18 47.21,5.79 v46.99,5.84 | 16.73,9.31 16.67,8.92 v16.89,8.89 | 16.73,9.31 17.03,9.07 v16.89,8.89 | 29.84,5.66 29.65,5.32 | v29.84,5.21 29.65,5.32 | 29.84,5.66 30.04,5.32 | 29.84,5.66 29.65,5.32 | 29.84,5.66 30.04,5.32 | v29.84,5.21 30.04,5.32 | 29.84,5.66 29.65,5.32 | v29.84,5.21 29.65,5.32 | 29.84,5.66 30.04,5.32 | v29.84,5.21 30.04,5.32 | 29.84,5.66 29.65,5.32 | v29.84,5.21 29.65,5.32 | 29.84,5.66 30.04,5.32 | v29.84,5.21 30.04,5.32 | 28.38,11.68 | 28.38,11.68 28.71,11.49 | 28.38,11.68 28.71,11.88 | v28.83,11.68 28.71,11.88 | v28.83,11.68 28.71,11.49 | 28.38,11.68 28.71,11.88 | v28.83,11.68 28.71,11.49 | v28.83,11.68 28.71,11.88 | v28.83,11.68 28.71,11.49 | v28.83,11.68 28.71,11.88 | 45.47,6.29 | 45.47,6.29 45.27,5.96 | v45.47,5.84 45.27,5.96
  Bottom 0.254: 45.47,6.29 45.66,5.96 | v45.47,5.84 45.66,5.96 | 45.15,5.52 45.52,5.62 v45.47,5.84 | 45.15,5.52 45.25,5.9 v45.47,5.84 | 45.47,6.29 45.27,5.96 | v45.47,5.84 45.27,5.96 | 45.47,6.29 45.66,5.96 | v45.47,5.84 45.66,5.96 | 45.47,6.29 45.27,5.96 | v45.47,5.84 45.27,5.96 | 45.47,6.29 45.66,5.96 | v45.47,5.84 45.66,5.96
+5V  (via drill 0.3)
  Top 0.254: J2.3 48.03,2.13 46.86,3.3 46.1,3.3 45.78,3.62 | 45.78,3.62 v45.47,3.94 | 45.78,3.62 45.69,4 v45.47,3.94 | 45.78,3.62 45.41,3.72 v45.47,3.94
  Top 0.508: 48.03,2.13 48.22,1.14 J2.3 49.02,1.94 48.03,2.13
  Bottom 0.254: C4.1 C1.1 13.75,8.25 U2.3 13.65,8.7 14.35,9.4 14.86,9.4 15.55,8.7 U2.1 | v45.47,3.94 45.21,3.68 45.09,3.68 | 45.09,3.68 31.54,3.68 30.9,4.32 28.19,4.32 27.05,5.46 23.75,5.46 22.35,4.06 14.77,4.06 C4.1 | C4.1 D1.C | 45.09,3.68 45.48,3.71 v45.47,3.94 | 45.09,3.68 45.26,4.03 v45.47,3.94
+BATT  (via drill 0.3)
  Top 0.254: J3.1 53.11,15.65 52.45,14.99 50.8,14.99 49.34,13.53 | v49.02,13.21 49.34,13.53 | 49.34,13.53 48.96,13.43 v49.02,13.21 | 49.34,13.53 49.24,13.15 v49.02,13.21
  Top 0.508: 53.11,15.65 54.1,15.84 J3.1 53.3,16.64 53.11,15.65
  Bottom 0.203: VD3.2 48.63,12.99 | 48.63,12.99 48.84,13.21 v49.02,13.21 | 48.63,12.99 49,12.96 v49.02,13.21 | 48.63,12.99 48.8,13.32 v49.02,13.21
AGND  (via drill 0.3)
  Top 0.203: U1.8 32.85,12.95 33.22,12.95 33.45,12.73 34.28,12.73 34.76,13.21 35.33,13.21 | 35.33,13.21 | 35.33,13.21 C11.1 | 35.33,13.21 | 35.33,13.21 35.63,13 | C11.1 35.63,13 | 35.33,13.21 35.63,13.42 | C11.1 35.63,13.42 | 35.33,13.21 35.63,13 | 35.63,13 | C11.1 35.63,13 | 35.33,13.21 35.63,13.42 | C11.1 35.63,13.42 | 35.33,13.21 35.63,13 | C11.1 35.63,13 | 35.33,13.21 35.63,13.42 | C11.1 35.63,13.42
  Bottom 0.203: C11.1 36.23,13.21 | 36.23,13.21 | 36.23,13.21 R14.1 | 35.92,13 | 35.92,13 | 36.23,13.21 35.92,13.42 | 36.23,13.21 35.92,13.42 | 35.92,13.42 | C11.1 35.92,13.42 | 36.23,13.21 35.92,13 | C11.1 35.92,13 | 35.92,13 | 36.23,13.21 35.92,13.42 | C11.1 35.92,13.42 | 36.23,13.21 35.92,13 | 35.92,13 | C11.1 35.92,13 | 36.23,13.21 35.92,13.42 | C11.1 35.92,13.42 | 36.23,13.21 | 36.23,13.21 35.92,13 | C11.1 35.92,13 | 36.23,13.21 35.92,13.42 | C11.1 35.92,13.42 | 36.23,13.21 35.92,13 | C11.1 35.92,13
  other vias: 35.77,13.21
BOOT0  (via drill 0.3)
  Top 0.152: U1.44 33.34,6.42 32.64,7.11 29.34,7.11 28.57,7.87 26.29,7.87 25.27,8.89 24.96,8.89 | 24.96,8.89 | 24.96,8.89 v24.51,8.89 | 24.96,8.89 24.68,9.11 | v24.51,8.89 24.68,9.11 | 24.96,8.89 24.68,8.67 | 24.96,8.89 24.68,9.11 | 24.96,8.89 24.68,8.67 | v24.51,8.89 24.68,8.67 | 24.96,8.89 24.68,9.11 | v24.51,8.89 24.68,9.11 | 24.96,8.89 24.68,8.67 | v24.51,8.89 24.68,8.67 | 24.96,8.89 24.68,9.11 | v24.51,8.89 24.68,9.11 | 24.96,8.89 24.68,8.67 | v24.51,8.89 24.68,8.67
  Bottom 0.152: v24.51,8.89 24.19,8.57 | 24.19,8.57 | 24.19,8.57 23.75,8.13 R7.1 | v24.51,8.89 24.19,9.21 | 24.19,9.21 | 24.19,9.21 23.75,9.65 R8.1 | 24.19,8.57 24.54,8.62 | 24.54,8.62 | 24.19,8.57 24.24,8.92 | 24.24,8.92 | 24.19,9.21 24.24,8.86 | 24.24,8.86 | 24.19,9.21 24.54,9.17 | 24.54,9.17 | 24.24,8.92 | 24.54,9.17 | 24.54,8.62 | v24.51,8.89 24.54,8.62 | 24.19,8.57 24.24,8.92 | v24.51,8.89 24.24,8.92 | 24.19,8.57 24.54,8.62 | v24.51,8.89 24.54,8.62 | 24.19,8.57 24.24,8.92 | v24.51,8.89 24.24,8.92 | 24.24,8.86 | v24.51,8.89 24.24,8.86 | 24.19,9.21 24.54,9.17 | v24.51,8.89 24.54,9.17 | 24.19,9.21 24.24,8.86 | v24.51,8.89 24.24,8.86 | 24.19,9.21 24.54,9.17 | v24.51,8.89 24.54,9.17
CC1
  Top 0.152: J1.A5 8.23,10.14 8.51,10.41 8.93,10.41 R1.1
CC2
  Top 0.152: J1.B5 8.23,7.14 8.76,6.6 R2.1
D+
  Top 0.152: J1.A6 7.75,9.14 8.01,8.88 8.01,8.39 | 8.01,8.39 8.01,8.37 8.38,8 9.18,8 VD1.3 9.97,7.94 10.29,7.62 10.79,7.62 11.11,7.94 VD1.4 12.35,7.94 13.68,6.6 R5.1 15.28,5.08 R4.1 | J1.B6 7.76,8.14 8.01,8.39
D-
  Top 0.152: J1.A7 6.73,8.64 6.48,8.89 6.48,9.4 6.72,9.64 J1.B7 8.24,9.64 8.38,9.78 9.18,9.78 VD1.1 9.97,9.84 10.29,10.16 10.79,10.16 11.11,9.84 VD1.6 12.38,9.84 12.74,9.49 12.74,9.14 R6.1
GND  (via drill 0.3)
  Top 0.254: v10.54,8.38 10.51,8.38 10.21,8.69 | VD1.2 10,8.89 10.21,8.69 | 6.43,12.39 6.4,12.36 5.93,12.36 5.64,12.06 | 5.64,12.06 5.6,12.02 5.6,11.97 | 5.6,11.97 5.6,11.57 5.52,11.49 | 5.52,11.49 v5.21,11.18 | 5.6,5.81 5.6,5.76 5.64,5.72 | 5.6,5.81 5.6,6.22 5.52,6.29 | 5.52,6.29 v5.21,6.6 | 6.43,5.39 5.97,5.39 5.64,5.72 | 10.21,8.69 10.32,8.31 v10.54,8.38 | 10.21,8.69 10.59,8.6 v10.54,8.38 | 5.52,11.49 5.15,11.39 v5.21,11.18 | 5.52,11.49 5.43,11.12 v5.21,11.18 | 5.52,6.29 5.43,6.66 v5.21,6.6 | 5.52,6.29 5.15,6.39 v5.21,6.6 | 5.6,5.81 5.21,5.81 v5.21,5.59 | 5.6,5.81 5.4,5.48 v5.21,5.59 | 5.64,5.72 5.26,5.81 v5.21,5.59 | 5.64,5.72 5.37,5.43 v5.21,5.59 | 5.64,12.06 5.37,12.35 v5.21,12.19 | 5.64,12.06 5.26,11.97 v5.21,12.19 | 5.6,11.97 5.4,12.3 v5.21,12.19 | 5.6,11.97 5.21,11.97 v5.21,12.19
  Top 0.33: J1.GND2 6.71,5.67 6.43,5.39 | J1.GND 6.71,12.12 6.43,12.39
  other vias: 3.94,3.56 5.71,8.89 9.27,14.22 29.84,8.89 19.18,11.56 31.11,6.48 38.61,11.94 41.78,8 39.12,13.21 11.43,6.6 37.21,6.1 30.99,11.56 41.27,13.21 43.31,13.21 45.09,7.11 35.43,9.53 35.43,8.26 41.78,5.33 56.9,6.35 56.9,8.89 56.9,11.43 3.94,14.22 47.88,13.84 18.16,8.89 16.76,12.83 45.09,15.24 47.62,4.32
  pour Bottom (rank 2): 59.44,-0.63 59.44,18.41 -0.64,18.41 -0.64,-0.63
  pour Top (rank 2): 59.44,18.41 59.44,-0.63 -0.64,-0.63 -0.64,18.41
N$1
  Top 0.152: R11.1 LED1.2
N$2  (via drill 0.3)
  Top 0.152: S1.1 20.64,7.11 | 20.64,7.11 | 20.64,7.11 v20.19,7.11 | 20.64,7.11 | 20.64,7.11 20.36,7.33 | 20.64,7.11 20.36,7.33 | 20.64,7.11 20.36,6.89 | v20.19,7.11 20.36,6.89 | 20.64,7.11 20.36,7.33 | v20.19,7.11 20.36,7.33 | 20.64,7.11 20.36,6.89 | 20.64,7.11 20.36,7.33 | v20.19,7.11 20.36,7.33 | 20.64,7.11 20.36,6.89 | v20.19,7.11 20.36,6.89 | 20.64,7.11 20.36,7.33 | v20.19,7.11 20.36,7.33 | 20.64,7.11 20.36,6.89 | v20.19,7.11 20.36,6.89
  Bottom 0.152: R7.2 21.21,8.13 20.51,7.43 | 20.51,7.43 v20.19,7.11 | 20.16,7.39 | 20.47,7.08 | 20.51,7.43 20.16,7.39 | 20.16,7.39 | 20.51,7.43 20.47,7.08 | v20.19,7.11 20.47,7.08 | 20.51,7.43 20.16,7.39 | v20.19,7.11 20.16,7.39 | 20.51,7.43 | 20.51,7.43 20.16,7.39 | 20.51,7.43 | 20.51,7.43 20.47,7.08 | 20.51,7.43 20.16,7.39 | v20.19,7.11 20.16,7.39 | 20.51,7.43 20.47,7.08 | v20.19,7.11 20.47,7.08 | 20.51,7.43 20.16,7.39 | v20.19,7.11 20.16,7.39 | 20.51,7.43 20.47,7.08 | v20.19,7.11 20.47,7.08
N$3
  Top 0.152: LED2.2 R12.1
N$4  (via drill 2.1 pad 3.3)  (3 unrouted)
  other vias: 1.9,15.88 1.9,1.91 57.78,1.91 57.78,15.88
N$5  (via drill 0.3)
  Top 0.152: U1.20 25.02,12.66 25.02,13.08 24.75,13.35 | 24.75,13.35 24.7,13.4 | 24.7,13.4 v24.38,13.72 | 24.75,13.35 24.68,13.77 v24.38,13.72 | 24.75,13.35 24.33,13.42 v24.38,13.72 | 24.7,13.4 24.66,13.75 v24.38,13.72 | 24.7,13.4 24.35,13.44 v24.38,13.72 | v24.38,13.72 24.65,13.78 24.74,13.44 24.38,13.44 v24.38,13.72 | v24.38,13.72 24.66,13.72 24.66,13.36 24.32,13.45 v24.38,13.72
  Bottom 0.152: v24.38,13.72 23.93,13.72 | 23.93,13.72 | 23.93,13.72 23.86,13.72 | 23.86,13.72 | 23.86,13.72 17.27,13.72 16.89,14.1 12.79,14.1 R15.1 | 23.86,13.72 | 23.94,13.66 24.21,13.47 | 24.21,13.47 | 23.86,13.72 24.21,13.96 | 24.21,13.96 | 23.86,13.72 23.94,13.66 | 23.94,13.66 24.21,13.47 | 24.21,13.47 | v24.38,13.72 24.21,13.47 | 23.86,13.72 23.94,13.77 | 23.94,13.77 24.21,13.96 | v24.38,13.72 24.21,13.96 | 23.86,13.72 23.94,13.66 | 23.94,13.66 24.21,13.47 | v24.38,13.72 24.21,13.47 | 23.86,13.72 23.94,13.77 | 23.94,13.77 24.21,13.96 | v24.38,13.72 24.21,13.96 | 23.94,13.66 24.24,13.48 | 23.94,13.77 24.24,13.95 | 23.93,13.72 | 23.93,13.72 24.21,13.5 | 23.93,13.72 24.21,13.93 | 23.94,13.77 24.19,13.52 | v24.38,13.72 24.19,13.52 | 23.94,13.77 24.24,13.95 | 24.24,13.95 | v24.38,13.72 24.24,13.95 | 23.94,13.66 24.19,13.91 | 24.19,13.91 | 23.93,13.72 24.21,13.5 | v24.38,13.72 24.21,13.5 | 23.93,13.72 24.21,13.93 | v24.38,13.72 24.21,13.93 | 23.93,13.72 24.21,13.5 | v24.38,13.72 24.21,13.5 | 23.93,13.72 24.21,13.93 | v24.38,13.72 24.21,13.93 | 23.94,13.66 24.24,13.48 | 24.24,13.48 | v24.38,13.72 24.24,13.48 | 23.94,13.66 24.19,13.91 | v24.38,13.72 24.19,13.91 | 23.94,13.77 24.19,13.52 | 23.94,13.77 24.24,13.95 | 23.94,13.66 24.24,13.48 | v24.38,13.72 24.24,13.48 | 23.94,13.66 24.19,13.91 | v24.38,13.72 24.19,13.91 | 23.94,13.77 24.19,13.52 | 24.19,13.52 | v24.38,13.72 24.19,13.52 | 23.94,13.77 24.24,13.95 | v24.38,13.72 24.24,13.95 | 23.94,13.66 24.24,13.48 | v24.38,13.72 24.24,13.48 | 23.94,13.66 24.19,13.91 | v24.38,13.72 24.19,13.91 | 23.94,13.77 24.19,13.52 | v24.38,13.72 24.19,13.52 | 23.94,13.77 24.24,13.95 | v24.38,13.72 24.24,13.95
N$6  (via drill 0.3)
  Top 0.254: F1.2 11.39,4.83 10.84,4.27 | 10.84,4.27 10.54,3.98 v10.54,3.94 | 10.84,4.27 10.47,4.15 v10.54,3.94 | 10.84,4.27 10.76,3.89 v10.54,3.94
  Bottom 0.254: D1.A 9.4,5.08 10.22,4.26 | v10.54,3.94 10.22,4.26 | 10.22,4.26 10.32,3.88 v10.54,3.94 | 10.22,4.26 10.6,4.16 v10.54,3.94
N$7  (via drill 0.3)
  Top 0.203: U1.9 32.67,13.49 33.45,13.49 | 33.88,13.49 33.45,13.49 | 33.45,13.49 33.69,13.2 v33.88,13.36 33.81,13.6 33.45,13.49
  Top 0.254: 30.16,12 30.48,12.32 31.51,12.32 U1.9 | 30.16,12 v29.84,11.68 | 33.88,13.49 v33.88,13.36 | 30.16,12 29.79,11.9 v29.84,11.68 | 30.16,12 30.06,11.63 v29.84,11.68
  Bottom 0.203: 33.92,13.36 v33.88,13.36
  Bottom 0.254: R13.1 28.66,12.45 29.08,12.45 29.53,12 | 29.53,12 v29.84,11.68 | C11.2 33.92,13.36 | 29.53,12 29.63,11.63 v29.84,11.68 | 29.53,12 29.9,11.9 v29.84,11.68
NRST  (via drill 0.3)
  Top 0.152: v30.86,10.67 31.27,10.67 31.31,10.71 | U1.7 31.31,10.71 | v20.19,10.67 19.74,10.67 | 19.74,10.67 | 19.74,10.67 S2.2 17.13,10.67 16.62,11.18 C3.1 R9.2 15.45,14.39 14.2,15.65 J3.17 | 31.31,10.71 31.01,10.9 v30.86,10.67 | 31.31,10.71 31.05,10.47 v30.86,10.67 | 19.74,10.67 | 19.74,10.67 20.02,10.45 | 19.74,10.67 20.02,10.45 | 19.74,10.67 20.02,10.89 | v20.19,10.67 20.02,10.89 | 19.74,10.67 20.02,10.45 | v20.19,10.67 20.02,10.45 | 19.74,10.67 20.02,10.89 | 19.74,10.67 20.02,10.45 | v20.19,10.67 20.02,10.45 | 19.74,10.67 20.02,10.89 | v20.19,10.67 20.02,10.89 | 19.74,10.67 20.02,10.45 | v20.19,10.67 20.02,10.45 | 19.74,10.67 20.02,10.89 | v20.19,10.67 20.02,10.89
  Top 0.305: 14.2,15.65 14.12,16.58 J3.17 13.27,15.73 14.2,15.65
  Bottom 0.152: v30.86,10.67 30.41,10.67 | 30.41,10.67 20.64,10.67 | 20.64,10.67 v20.19,10.67 | 30.41,10.67 30.69,10.45 v30.86,10.67 | 30.41,10.67 30.69,10.89 v30.86,10.67 | 20.64,10.67 20.36,10.89 v20.19,10.67 | 20.64,10.67 20.36,10.45 v20.19,10.67
OSC_IN
  Top 0.152: ZO1.3 42.99,10.99 41.43,10.99 C8.2 39.59,10.67 37.34,10.67 36.07,11.94 33.95,11.94 U1.5
OSC_OUT
  Top 0.152: ZO1.1 40.48,12.07 C9.2 39.59,11.18 37.52,11.18 36.37,12.32 33.63,12.32 U1.6
PA0
  Top 0.152: U1.10 32.58,14.1 37.85,14.1 38.23,14.48 40,14.48 40.51,14.99 42.29,14.99 42.95,15.65 J3.5
  Top 0.305: 42.95,15.65 43.88,15.73 J3.5 43.03,16.58 42.95,15.65
PA1
  Top 0.152: U1.11 32.25,14.48 37.46,14.48 37.97,14.99 39.75,14.99 40.41,15.65 J3.6
  Top 0.305: 40.41,15.65 41.34,15.73 J3.6 40.49,16.58 40.41,15.65
PA2
  Top 0.152: U1.12 32.05,14.99 37.21,14.99 37.87,15.65 J3.7
  Top 0.305: 37.87,15.65 38.8,15.73 J3.7 37.95,16.58 37.87,15.65
PA3  (via drill 0.3)
  Top 0.152: U1.13 29.17,14.22 29.65,14.22 | 29.65,14.22 | 29.65,14.22 v30.1,14.22 | 29.65,14.22 | 29.65,14.22 29.93,14.01 | 29.65,14.22 29.93,14.01 | 29.65,14.22 29.93,14.44 | v30.1,14.22 29.93,14.44 | 29.65,14.22 29.93,14.01 | v30.1,14.22 29.93,14.01 | 29.65,14.22 29.93,14.44 | 29.65,14.22 29.93,14.01 | v30.1,14.22 29.93,14.01 | 29.65,14.22 29.93,14.44 | v30.1,14.22 29.93,14.44 | 29.65,14.22 29.93,14.01 | v30.1,14.22 29.93,14.01 | 29.65,14.22 29.93,14.44 | v30.1,14.22 29.93,14.44
  Bottom 0.152: v30.1,14.22 30.55,14.22 | 30.55,14.22 | 30.55,14.22 30.86,14.22 31.11,14.48 32.38,14.48 32.89,14.99 34.67,14.99 35.33,15.65 J3.8 | 30.55,14.22 30.27,14.44 | 30.55,14.22 30.27,14.01 | 30.55,14.22 | 30.55,14.22 30.27,14.44 | 30.27,14.44 | 30.55,14.22 | 30.55,14.22 30.27,14.44 | 30.55,14.22 | 30.55,14.22 30.27,14.01 | v30.1,14.22 30.27,14.01 | 30.55,14.22 30.27,14.44 | 30.27,14.44 | 30.55,14.22 30.27,14.44 | v30.1,14.22 30.27,14.44 | 30.55,14.22 30.27,14.01 | 30.27,14.01 | 30.27,14.01 | v30.1,14.22 30.27,14.01 | 30.55,14.22 30.27,14.44 | v30.1,14.22 30.27,14.44 | 30.55,14.22 30.27,14.01 | v30.1,14.22 30.27,14.01 | 30.55,14.22 30.27,14.44 | v30.1,14.22 30.27,14.44 | 30.55,14.22 30.27,14.01 | v30.1,14.22 30.27,14.01
  Bottom 0.305: 35.33,15.65 36.26,15.73 J3.8 35.41,16.58 35.33,15.65
PA4  (via drill 0.3)
  Top 0.152: U1.14 29.22,12.7 29.39,12.7 | 29.39,12.7 | 29.39,12.7 v29.84,12.7 | 29.39,12.7 | 29.39,12.7 29.67,12.48 | 29.39,12.7 29.67,12.48 | 29.39,12.7 29.67,12.92 | v29.84,12.7 29.67,12.92 | 29.39,12.7 29.67,12.48 | v29.84,12.7 29.67,12.48 | 29.39,12.7 29.67,12.92 | 29.39,12.7 29.67,12.48 | v29.84,12.7 29.67,12.48 | 29.39,12.7 29.67,12.92 | v29.84,12.7 29.67,12.92 | 29.39,12.7 29.67,12.48 | v29.84,12.7 29.67,12.48 | 29.39,12.7 29.67,12.92 | v29.84,12.7 29.67,12.92
  Bottom 0.152: v29.84,12.7 29.53,13.02 | 29.53,13.02 | 29.53,13.02 29.34,13.21 29.34,14.48 29.84,14.99 32.13,14.99 32.79,15.65 J3.9 | 29.53,13.02 29.57,12.67 | 29.57,12.67 | 29.53,13.02 29.88,12.98 | 29.88,12.98 | 29.88,12.98 | 29.57,12.67 | v29.84,12.7 29.57,12.67 | 29.53,13.02 29.88,12.98 | v29.84,12.7 29.88,12.98 | 29.53,13.02 29.57,12.67 | v29.84,12.7 29.57,12.67 | 29.53,13.02 29.88,12.98 | v29.84,12.7 29.88,12.98
  Bottom 0.305: 32.79,15.65 33.72,15.73 J3.9 32.87,16.58 32.79,15.65
PA5
  Top 0.152: U1.15 27.56,13.65 27.56,13.97 28.57,14.99 29.59,14.99 30.25,15.65 J3.10
  Top 0.305: 30.25,15.65 31.18,15.73 J3.10 30.33,16.58 30.25,15.65
PA6
  Top 0.152: U1.16 27.05,13.45 27.05,14.99 27.71,15.65 J3.11
  Top 0.305: 27.71,15.65 28.64,15.73 J3.11 27.79,16.58 27.71,15.65
PA7
  Top 0.152: U1.17 26.54,13.25 26.54,14.48 26.04,14.99 26.04,15.29 J3.12
  Top 0.305: 26.04,15.29 26.64,16 J3.12 25.43,16 26.04,15.29
PA8
  Top 0.152: U1.29 26.31,6.37 23.75,3.81 21.97,3.81 21.46,3.3 19.68,3.3 19.18,2.79 17.4,2.79 16.74,2.13 J2.16
  Top 0.305: 16.74,2.13 15.81,2.06 J2.16 16.66,1.2 16.74,2.13
PA9
  Top 0.152: U1.30 23.9,3.3 22.22,3.3 21.72,2.79 19.94,2.79 19.28,2.13 J2.15
  Top 0.305: 19.28,2.13 18.35,2.06 J2.15 19.2,1.2 19.28,2.13
PA10
  Top 0.152: U1.31 24.1,2.79 22.48,2.79 21.82,2.13 J2.14
  Top 0.305: 21.82,2.13 20.89,2.06 J2.14 21.74,1.2 21.82,2.13
PA11/USB_DM  (via drill 0.3)
  Top 0.152: 28.07,6.41 28.07,6.05 U1.32 24.25,2.23 23.49,1.48 J2.13 | 28.07,6.41 | 28.07,6.41 v28.07,6.86 | v16.89,6.6 16.89,6.86 16.73,7.02 | 16.73,7.02 15.62,8.13 R6.2 | 28.07,6.41 | 28.07,6.41 28.29,6.69 | 28.07,6.41 28.29,6.69 | 28.07,6.41 27.85,6.69 | v28.07,6.86 27.85,6.69 | 28.07,6.41 28.29,6.69 | v28.07,6.86 28.29,6.69 | 28.07,6.41 27.85,6.69 | 28.07,6.41 28.29,6.69 | v28.07,6.86 28.29,6.69 | 28.07,6.41 27.85,6.69 | v28.07,6.86 27.85,6.69 | 28.07,6.41 28.29,6.69 | v28.07,6.86 28.29,6.69 | 28.07,6.41 27.85,6.69 | v28.07,6.86 27.85,6.69 | 16.73,7.02 16.62,6.68 v16.89,6.6 | 16.73,7.02 17.03,6.84 v16.89,6.6
  Top 0.305: 24.25,2.23 23.34,2.04 J2.13 24.28,1.3 24.25,2.23
  Bottom 0.152: 17.34,6.6 17.53,6.6 17.78,6.35 22.22,6.35 22.73,6.86 27.62,6.86 | 17.34,6.6 | 17.34,6.6 v16.89,6.6 | v28.07,6.86 27.62,6.86 | 27.62,6.86 | 27.62,6.86 27.9,6.64 | 27.62,6.86 27.9,7.08 | 27.62,6.86 | 27.62,6.86 27.9,6.64 | 27.9,6.64 | 27.62,6.86 | 27.62,6.86 27.9,6.64 | 27.62,6.86 | 27.62,6.86 27.9,7.08 | v28.07,6.86 27.9,7.08 | 27.62,6.86 27.9,6.64 | 27.9,6.64 | 27.62,6.86 27.9,6.64 | v28.07,6.86 27.9,6.64 | 27.62,6.86 27.9,7.08 | 27.9,7.08 | 27.9,7.08 | v28.07,6.86 27.9,7.08 | 27.62,6.86 27.9,6.64 | v28.07,6.86 27.9,6.64 | 27.62,6.86 27.9,7.08 | v28.07,6.86 27.9,7.08 | 27.62,6.86 27.9,6.64 | v28.07,6.86 27.9,6.64 | 27.62,6.86 27.9,7.08 | v28.07,6.86 27.9,7.08 | 17.34,6.6 17.06,6.82 | 17.34,6.6 | 17.34,6.6 17.06,6.82 | v16.89,6.6 17.06,6.82 | 17.34,6.6 17.06,6.39 | 17.34,6.6 | 17.34,6.6 17.06,6.82 | 17.34,6.6 | 17.34,6.6 17.06,6.39 | 17.06,6.39 | 17.34,6.6 17.06,6.39 | v16.89,6.6 17.06,6.39 | 17.34,6.6 17.06,6.82 | v16.89,6.6 17.06,6.82 | 17.34,6.6 17.06,6.39 | 17.06,6.39 | 17.34,6.6 17.06,6.82 | 17.06,6.82 | v16.89,6.6 17.06,6.82 | 17.34,6.6 17.06,6.39 | v16.89,6.6 17.06,6.39 | 17.34,6.6 17.06,6.82 | v16.89,6.6 17.06,6.82 | 17.34,6.6 17.06,6.39 | v16.89,6.6 17.06,6.39
PA12/USB_DP  (via drill 0.3)
  Top 0.152: 28.51,5.78 U1.33 26.04,3.31 26.04,2.49 J2.12 | 28.51,5.78 v28.82,6.1 v28.83,6.1 | R5.2 16.44,5.62 | 16.44,5.62 16.47,5.59 v16.89,5.59 | 28.51,5.78 28.86,5.82 v28.83,6.1 | 28.51,5.78 28.55,6.13 v28.83,6.1 | 16.44,5.62 16.71,5.38 v16.89,5.59 | 16.44,5.62 16.73,5.82 v16.89,5.59
  Top 0.305: 26.04,2.49 25.43,1.78 J2.12 26.64,1.78 26.04,2.49
  Bottom 0.152: 17.34,5.59 17.4,5.59 17.78,5.97 22.61,5.97 23.11,6.48 27.43,6.48 27.81,6.1 28.38,6.1 | 17.34,5.59 | 17.34,5.59 v16.89,5.59 | v28.83,6.1 28.38,6.1 | 28.38,6.1 | 28.38,6.1 28.66,5.88 | 28.38,6.1 28.66,6.31 | 28.38,6.1 | 28.38,6.1 28.66,5.88 | 28.66,5.88 | 28.38,6.1 | 28.38,6.1 28.66,5.88 | 28.38,6.1 | 28.38,6.1 28.66,6.31 | v28.83,6.1 28.66,6.31 | 28.38,6.1 28.66,5.88 | 28.66,5.88 | 28.38,6.1 28.66,5.88 | v28.83,6.1 28.66,5.88 | 28.38,6.1 28.66,6.31 | 28.66,6.31 | 28.66,6.31 | v28.83,6.1 28.66,6.31 | 28.38,6.1 28.66,5.88 | v28.83,6.1 28.66,5.88 | 28.38,6.1 28.66,6.31 | v28.83,6.1 28.66,6.31 | 28.38,6.1 28.66,5.88 | v28.83,6.1 28.66,5.88 | 28.38,6.1 28.66,6.31 | v28.83,6.1 28.66,6.31 | 17.34,5.59 17.06,5.81 | 17.34,5.59 | 17.34,5.59 17.06,5.81 | v16.89,5.59 17.06,5.81 | 17.34,5.59 17.06,5.37 | 17.34,5.59 | 17.34,5.59 17.06,5.81 | 17.34,5.59 | 17.34,5.59 17.06,5.37 | 17.06,5.37 | 17.34,5.59 17.06,5.37 | v16.89,5.59 17.06,5.37 | 17.34,5.59 17.06,5.81 | v16.89,5.59 17.06,5.81 | 17.34,5.59 17.06,5.37 | 17.06,5.37 | 17.34,5.59 17.06,5.81 | 17.06,5.81 | v16.89,5.59 17.06,5.81 | 17.34,5.59 17.06,5.37 | v16.89,5.59 17.06,5.37 | 17.34,5.59 17.06,5.81 | v16.89,5.59 17.06,5.81 | 17.34,5.59 17.06,5.37 | v16.89,5.59 17.06,5.37
PA13/SWDIO  (via drill 0.3)
  Top 0.152: U1.34 27.57,4.14 27.57,3.55 28.32,2.79 29.59,2.79 30.04,3.24 | v30.35,3.56 30.04,3.24 | 30.04,3.24 | 30.04,3.24 30.39,3.28 | 30.39,3.28 | 30.04,3.24 | 30.04,3.24 30.08,3.59 | 30.08,3.59 | 30.39,3.28 | 30.04,3.24 | 30.04,3.24 30.39,3.28 | v30.35,3.56 30.39,3.28 | 30.04,3.24 30.08,3.59 | 30.08,3.59 | 30.04,3.24 30.39,3.28 | v30.35,3.56 30.39,3.28 | 30.04,3.24 30.08,3.59 | v30.35,3.56 30.08,3.59 | 30.04,3.24 30.39,3.28 | v30.35,3.56 30.39,3.28 | 30.04,3.24 30.08,3.59 | v30.35,3.56 30.08,3.59
  Bottom 0.152: 30.67,3.24 30.73,3.18 45.65,3.18 46,3.53 47.94,3.53 48.58,4.16 VD2.1 VD2.6 49.34,7.14 49.81,7.62 J4.2 | 30.67,3.24 | 30.67,3.24 v30.35,3.56 | 30.67,3.24 30.63,3.59 | 30.63,3.59 | 30.67,3.24 30.32,3.28 | 30.32,3.28 | 30.32,3.28 | 30.63,3.59 | v30.35,3.56 30.63,3.59 | 30.67,3.24 30.32,3.28 | v30.35,3.56 30.32,3.28 | 30.67,3.24 30.63,3.59 | 30.67,3.24 30.32,3.28 | v30.35,3.56 30.32,3.28
PA14/SWCLK  (via drill 0.3)
  Top 0.152: U1.37 30.48,4.37 30.48,5.39 | v30.48,5.84 30.48,5.39 | 30.48,5.39 | 30.48,5.39 30.26,5.67 | 30.48,5.39 30.7,5.67 | v30.48,5.84 30.7,5.67 | 30.48,5.39 30.26,5.67 | 30.48,5.39 30.7,5.67 | v30.48,5.84 30.7,5.67 | 30.48,5.39 30.26,5.67 | v30.48,5.84 30.26,5.67 | 30.48,5.39 30.7,5.67 | 30.48,5.39 | 30.48,5.39 30.26,5.67 | v30.48,5.84 30.26,5.67 | 30.48,5.39 30.7,5.67 | v30.48,5.84 30.7,5.67 | 30.48,5.39 30.26,5.67 | v30.48,5.84 30.26,5.67
  Bottom 0.152: 30.8,5.52 | 30.8,5.52 32.13,4.19 44.7,4.19 45.34,4.83 45.72,4.83 46.23,5.33 | J4.3 50.57,9.3 49.34,8.06 47.31,8.06 46.67,7.43 VD2.4 46.67,6.8 46.23,6.35 46.23,5.33 | 30.8,5.52 30.75,5.88 | 30.75,5.88 | 30.8,5.52 30.45,5.57 | 30.45,5.57 | VD2.3 46.67,4.89 46.23,5.33 | 30.45,5.57 | v30.48,5.84 30.7,5.67 | 30.75,5.88 | v30.48,5.84 30.75,5.88 | 30.8,5.52 30.45,5.57 | v30.48,5.84 30.45,5.57 | 30.8,5.52 30.75,5.88 | v30.48,5.84 30.75,5.88 | 30.8,5.52 30.45,5.57
  Bottom 0.305: 50.57,9.3 51.5,9.38 J4.3 50.65,10.23 50.57,9.3
PA15
  Top 0.152: U1.38 31.88,3.68 31.88,3.3 31.37,2.79 30.1,2.79 29.44,2.13 J2.11
  Top 0.305: 29.44,2.13 28.51,2.06 J2.11 29.36,1.2 29.44,2.13
PB0
  Top 0.152: U1.18 26.04,13.05 26.04,13.21 26.04,13.97 24.36,15.65 J3.13
  Top 0.305: 24.36,15.65 24.28,16.58 J3.13 23.43,15.73 24.36,15.65
PB1
  Top 0.152: U1.19 25.53,12.85 25.53,13.72 24.26,14.99 22.48,14.99 21.82,15.65 J3.14
  Top 0.305: 21.82,15.65 21.74,16.58 J3.14 20.89,15.73 21.82,15.65
PB2/B00T1
  Bottom 0.152: R15.2 8.25,14.14 8.25,15.29
  Bottom 0.305: 8.25,15.29 8.86,16 J3.19 | 8.25,15.29 7.65,16 J3.19 | 8.25,15.29 J3.19
PB3
  Top 0.152: U1.39 32.38,3.88 32.38,2.54 31.98,2.13 J2.10
  Top 0.305: 31.98,2.13 31.05,2.06 J2.10 31.9,1.2 31.98,2.13
PB4
  Top 0.152: U1.40 33.66,3.31 33.66,2.49 J2.9
  Top 0.305: 33.66,2.49 33.05,1.78 J2.9 34.26,1.78 33.66,2.49
PB5
  Top 0.152: U1.41 34.16,3.51 34.16,3.3 35.33,2.13 J2.8
  Top 0.305: 35.33,2.13 35.41,1.2 J2.8 36.26,2.06 35.33,2.13
PB6
  Top 0.152: U1.42 35.59,2.79 37.21,2.79 37.87,2.13 J2.7
  Top 0.305: 37.87,2.13 37.95,1.2 J2.7 38.8,2.06 37.87,2.13
PB7
  Top 0.152: U1.43 35.79,3.3 37.46,3.3 37.97,2.79 39.75,2.79 40.41,2.13 J2.6
  Top 0.305: 40.41,2.13 40.49,1.2 J2.6 41.34,2.06 40.41,2.13
PB8
  Top 0.152: U1.45 34.29,6.21 34.29,5.46 35.94,3.81 37.72,3.81 38.23,3.3 40,3.3 40.51,2.79 42.29,2.79 42.95,2.13 J2.5
  Top 0.305: 42.95,2.13 43.03,1.2 J2.5 43.88,2.06 42.95,2.13
PB9
  Top 0.152: U1.46 34.8,6.41 34.8,5.72 36.2,4.32 37.97,4.32 38.48,3.81 40.26,3.81 40.77,3.3 42.55,3.3 43.05,2.79 44.83,2.79 45.49,2.13 J2.4
  Top 0.305: 45.49,2.13 45.57,1.2 J2.4 46.42,2.06 45.49,2.13
PB10
  Top 0.152: J3.15 19.28,15.65 19.94,14.99 21.46,14.99 21.97,14.48 22.49,14.48 U1.21
  Top 0.305: 19.28,15.65 19.2,16.58 J3.15 18.35,15.73 19.28,15.65
PB11
  Top 0.152: U1.22 22.29,13.97 21.72,13.97 21.21,14.48 19.68,14.48 19.18,14.99 17.4,14.99 16.74,15.65 J3.16
  Top 0.305: 16.74,15.65 16.66,16.58 J3.16 15.81,15.73 16.74,15.65
PB12
  Top 0.152: U1.25 22.91,5.84 20.95,5.84 20.45,5.33 18.67,5.33 18.16,4.83 16.64,4.83 16.13,4.32 14.1,4.32 13.59,3.81 11.81,3.81 11.3,3.3 9.27,3.3 8.76,2.79 7.24,2.79 6.58,2.13 J2.20
  Top 0.305: 6.58,2.13 5.65,2.06 J2.20 6.5,1.2 6.58,2.13
PB13
  Top 0.152: U1.26 23.11,5.33 21.21,5.33 20.7,4.83 18.92,4.83 18.41,4.32 16.76,4.32 16.26,3.81 14.35,3.81 13.84,3.3 12.06,3.3 11.56,2.79 9.78,2.79 9.12,2.13 J2.19
  Top 0.305: 9.12,2.13 8.19,2.06 J2.19 9.04,1.2 9.12,2.13
PB14
  Top 0.152: U1.27 23.31,4.83 21.46,4.83 20.95,4.32 19.18,4.32 18.67,3.81 16.89,3.81 16.38,3.3 14.6,3.3 14.1,2.79 12.32,2.79 11.66,2.13 J2.18
  Top 0.305: 11.66,2.13 10.73,2.06 J2.18 11.58,1.2 11.66,2.13
PB15
  Top 0.152: U1.28 23.5,4.32 21.72,4.32 21.21,3.81 19.43,3.81 18.92,3.3 17.14,3.3 16.64,2.79 14.86,2.79 14.2,2.13 J2.17
  Top 0.305: 14.2,2.13 13.27,2.06 J2.17 14.12,1.2 14.2,2.13
PC13  (via drill 0.3)  (1 unrouted)
  Top 0.152: J3.2 50.57,15.65 47.62,12.7 47.62,10.76 47.12,10.25 | U1.2 33.92,9.78 33.27,9.78 33.21,9.84 | 33.21,9.84 | 33.21,9.84 v32.89,10.16 | 47.12,10.25 47.08,10.21 | 47.09,10.29 | 47.09,10.29 v46.77,9.97 | 33.21,9.84 33.17,10.19 | 33.17,10.19 | 33.21,9.84 | 33.21,9.84 32.86,9.88 | 32.86,9.88 | 33.17,10.19 | 33.21,9.84 | 33.21,9.84 33.17,10.19 | v32.89,10.16 33.17,10.19 | 33.21,9.84 32.86,9.88 | 32.86,9.88 | 47.09,10.29 46.74,10.24 | 46.74,10.24 | 47.09,10.29 47.08,10.21 | 47.08,10.21 47.05,9.94 | 47.05,9.94 | 47.05,9.94 | v32.89,10.16 33.11,9.99 32.89,9.71 32.67,9.99 v32.89,10.16 | 33.21,9.84 33.17,10.19 | v32.89,10.16 33.17,10.19 | 33.21,9.84 32.86,9.88 | v32.89,10.16 32.86,9.88 | 33.21,9.84 33.17,10.19 | v32.89,10.16 33.17,10.19 | 33.21,9.84 32.86,9.88 | v32.89,10.16 32.86,9.88 | 47.12,10.25 46.77,10.25 v46.77,9.97 | 47.12,10.25 47.05,9.91 v46.77,9.97 | 46.74,10.24 | v46.77,9.97 46.74,10.24 | 47.09,10.29 47.05,9.94 | v46.77,9.97 47.05,9.94 | 47.09,10.29 46.74,10.24 | v46.77,9.97 46.74,10.24 | 47.09,10.29 47.05,9.94 | v46.77,9.97 47.05,9.94
  Top 0.305: 50.57,15.65 51.5,15.73 J3.2 50.65,16.58 50.57,15.65
  Bottom 0.152: v46.77,9.97 46.77,10.42 | 46.77,10.42 | 46.77,10.42 46.77,10.79 45.59,12.05 45.59,13.08 44.7,13.97 33.4,13.97 32.38,12.95 32.38,10.67 32.57,10.48 | v32.89,10.16 32.57,10.48 | 32.57,10.48 | 32.57,10.48 | 32.57,10.48 32.62,10.13 | 32.62,10.13 | 32.57,10.48 32.93,10.44 | 32.93,10.44 | 32.57,10.48 32.93,10.44 | v32.89,10.16 32.93,10.44 | 32.57,10.48 32.62,10.13 | 32.62,10.13 | 32.57,10.48 | 32.57,10.48 32.93,10.44 | 32.57,10.48 32.62,10.13 | v32.89,10.16 32.62,10.13 | 32.57,10.48 32.93,10.44 | v32.89,10.16 32.93,10.44 | 32.57,10.48 32.62,10.13 | v32.89,10.16 32.62,10.13 | 32.57,10.48 32.93,10.44 | v32.89,10.16 32.93,10.44 | 46.77,10.42 46.56,10.14 | 46.77,10.42 | 46.77,10.42 46.56,10.14 | v46.77,9.97 46.56,10.14 | 46.77,10.42 46.99,10.14 | 46.77,10.42 | 46.77,10.42 46.56,10.14 | 46.77,10.42 | 46.77,10.42 46.99,10.14 | 46.99,10.14 | 46.77,10.42 46.99,10.14 | v46.77,9.97 46.99,10.14 | 46.77,10.42 46.56,10.14 | v46.77,9.97 46.56,10.14 | 46.77,10.42 46.99,10.14 | 46.99,10.14 | 46.77,10.42 46.56,10.14 | 46.56,10.14 | v46.77,9.97 46.56,10.14 | 46.77,10.42 46.99,10.14 | v46.77,9.97 46.99,10.14 | 46.77,10.42 46.56,10.14 | v46.77,9.97 46.56,10.14 | 46.77,10.42 46.99,10.14 | v46.77,9.97 46.99,10.14
PC14/OSC32_IN
  Top 0.152: U1.3 34.61,11.18 35.69,11.18 36.2,10.67 36.2,8.8 R10.2 36.96,7.37 37.72,6.6 39.59,6.6 C7.2 41.11,6.6 41.93,6.6 42.93,5.61 ZO2.2 43.69,5.61 44.39,6.31 44.39,7.43 45.85,8.89 45.85,13.46 48.03,15.65 J3.3
  Top 0.305: 48.03,15.65 48.96,15.73 J3.3 48.11,16.58 48.03,15.65
PC15/OSC32_OUT
  Top 0.152: U1.4 34.28,11.56 35.9,11.56 36.96,10.5 R10.1 37.72,8.98 37.72,7.37 37.97,7.11 39.59,7.11 C6.2 41.11,7.11 41.93,7.11 42.93,8.11 ZO2.1 44.56,8.11 45.47,9.02 45.47,13.84 46.36,14.73 46.36,15.29 J3.4
  Top 0.305: 46.36,15.29 46.96,16 J3.4 45.75,16 46.36,15.29
SHLD  (via drill 0.3)  (8 unrouted)
  Top 0.508: R3.2 9.18,13.21 7.94,13.21 J1.SHLD1
  other vias: 1.14,11.18 1.14,6.6
  pour Top: 0,15.88 0,1.91 2.67,4.57 6.35,4.57 6.35,4.7 4.7,4.7 3.05,6.35 3.05,11.43 4.7,13.08 8.38,13.08 8.51,13.21 2.67,13.21
VBAT_PRO  (via drill 0.3)
  Top 0.254: U1.1 33.96,9.12 33.03,9.12 | v32.64,8.89 32.87,9.12 33.03,9.12 | 33.03,9.12 32.64,9.12 v32.64,8.89 | 33.03,9.12 32.84,8.78 v32.64,8.89
  Bottom 0.254: VD3.3 46.74,11.83 46.47,11.83 46.04,12.25 46.04,13.26 44.83,14.48 33.15,14.48 31.88,13.21 31.88,9.65 32.32,9.21 | v32.64,8.89 32.32,9.21 | v32.64,8.89 C10.1 | 32.32,9.21 32.42,8.83 v32.64,8.89 | 32.32,9.21 32.7,9.11 v32.64,8.89
VBUS
  Top 0.254: J1.VBUS1 6.64,11.34 4.95,9.65 4.95,8.13 6.64,6.44 J1.VBUS2 8.16,6.44 9.52,5.08 F1.1

### Text on the board
tPlace: GND | B2 | 3V3 | RST | B11 | B10 | B1 | B0 | A7 | A6 | A5 | A4 | A3 | A2 | A1 | A0 | C15 | C14 | C13 | VBT | RESET | GND | SCK | DarkPill V1.1 | DIO | BOOT0 | 3V3 | 32.768kHz | B12 | B13 | B14 | B15 | A8 | A9 | A10 | A11 | A12 | A15 | B3 | B4 | B5 | B6 | B7 | B8 | B9 | 5V | GND | 3V3
bPlace: GND | B2 | 3V3 | RST | B11 | B10 | B1 | B0 | A7 | A6 | A5 | A4 | A3 | A2 | A1 | A0 | C15 | C14 | C13 | VBT | GND | OldGerman | SWSCK | DarkPill V1.1 | SWDIO | 3V3 | B12 | B13 | B14 | B15 | A8 | A9 | A10 | A11 | A12 | A15 | B3 | B4 | B5 | B6 | B7 | B8 | B9 | 5V | GND | 3V3
tDocu: OldGerman(过气德国佬)